# Altium project OpenPack_BATMOD_V1p0.PrjPcb
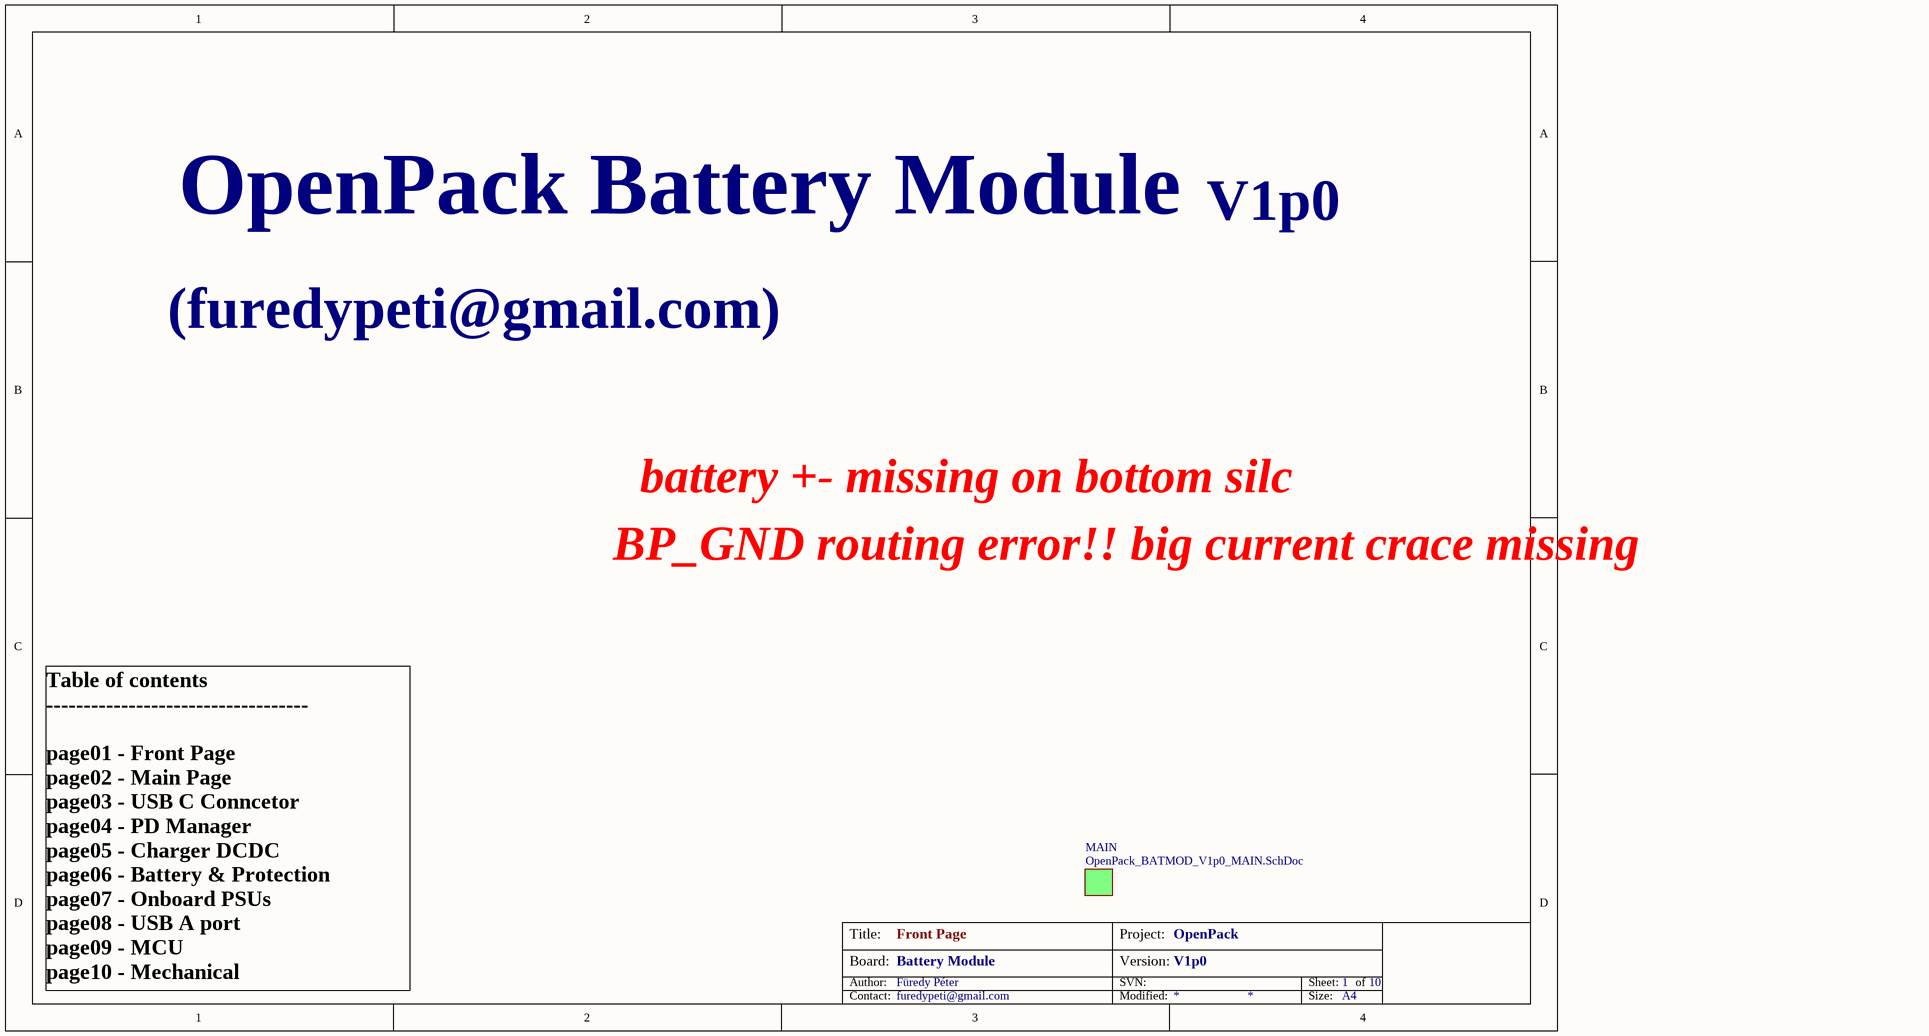
[diagram p0: OpenPack_BATMOD_V1p0_FRP.SchDoc]
GAuthor: Füredy Péter; GBoardName: Battery Module; GContact: furedypeti@gmail.com; GProjectName: OpenPack; GVersion: V1p0
10 sheets, 233 parts. Net scope: flat (ports and power ports of the same name join across sheets).
Board file: OpenPack_BATMOD_V1p0.PcbDoc
Sheets:
  OpenPack_BATMOD_V1p0_FRP.SchDoc
    MAIN = OpenPack_BATMOD_V1p0_MAIN.SchDoc
      MECH = OpenPack_BATMOD_V1p0_MECH.SchDoc
      CHRG = OpenPack_BATMOD_V1p0_CHRG.SchDoc
      PWR = OpenPack_BATMOD_V1p0_PWR.SchDoc
      MAN = OpenPack_BATMOD_V1p0_MAN.SchDoc
      USBC = OpenPack_BATMOD_V1p0_USBC.SchDoc
      USBA1 = OpenPack_BATMOD_V1p0_USBA.SchDoc
      USBA2 = OpenPack_BATMOD_V1p0_USBA.SchDoc
      BAT = OpenPack_BATMOD_V1p0_BAT.SchDoc
      MCU = OpenPack_BATMOD_V1p0_MCU.SchDoc

## Sheet OpenPack_BATMOD_V1p0_FRP.SchDoc
size A4; DocumentNumber: 1; SheetNumber: 1; SheetTotal: 10; Title_: Front Page

### Sub-sheets
MAIN = OpenPack_BATMOD_V1p0_MAIN.SchDoc: no entries

### Notes on the sheet
- (furedypeti@gmail.com)
- battery +- missing on bottom silc
- BP_GND routing error!! big current crace missing
- Table of contents
  -----------------------------------
  page01 - Front Page
  page02 - Main Page
  page03 - USB C Conncetor
  page04 - PD Manager
  page05 - Charger DCDC
  page06 - Battery & Protection
  page07 - Onboard PSUs
  page08 - USB A port
  page09 - MCU
  page10 - Mechanical
- Board:
- Author:
- Title:
- Project:
- SVN:
- Version:
- Sheet:
- of
- Contact:
- Modified:
- Size:
- A4

## Sheet OpenPack_BATMOD_V1p0_MAIN.SchDoc
size A4; SheetNumber: 2; SheetTotal: 10; Title_: Main Page
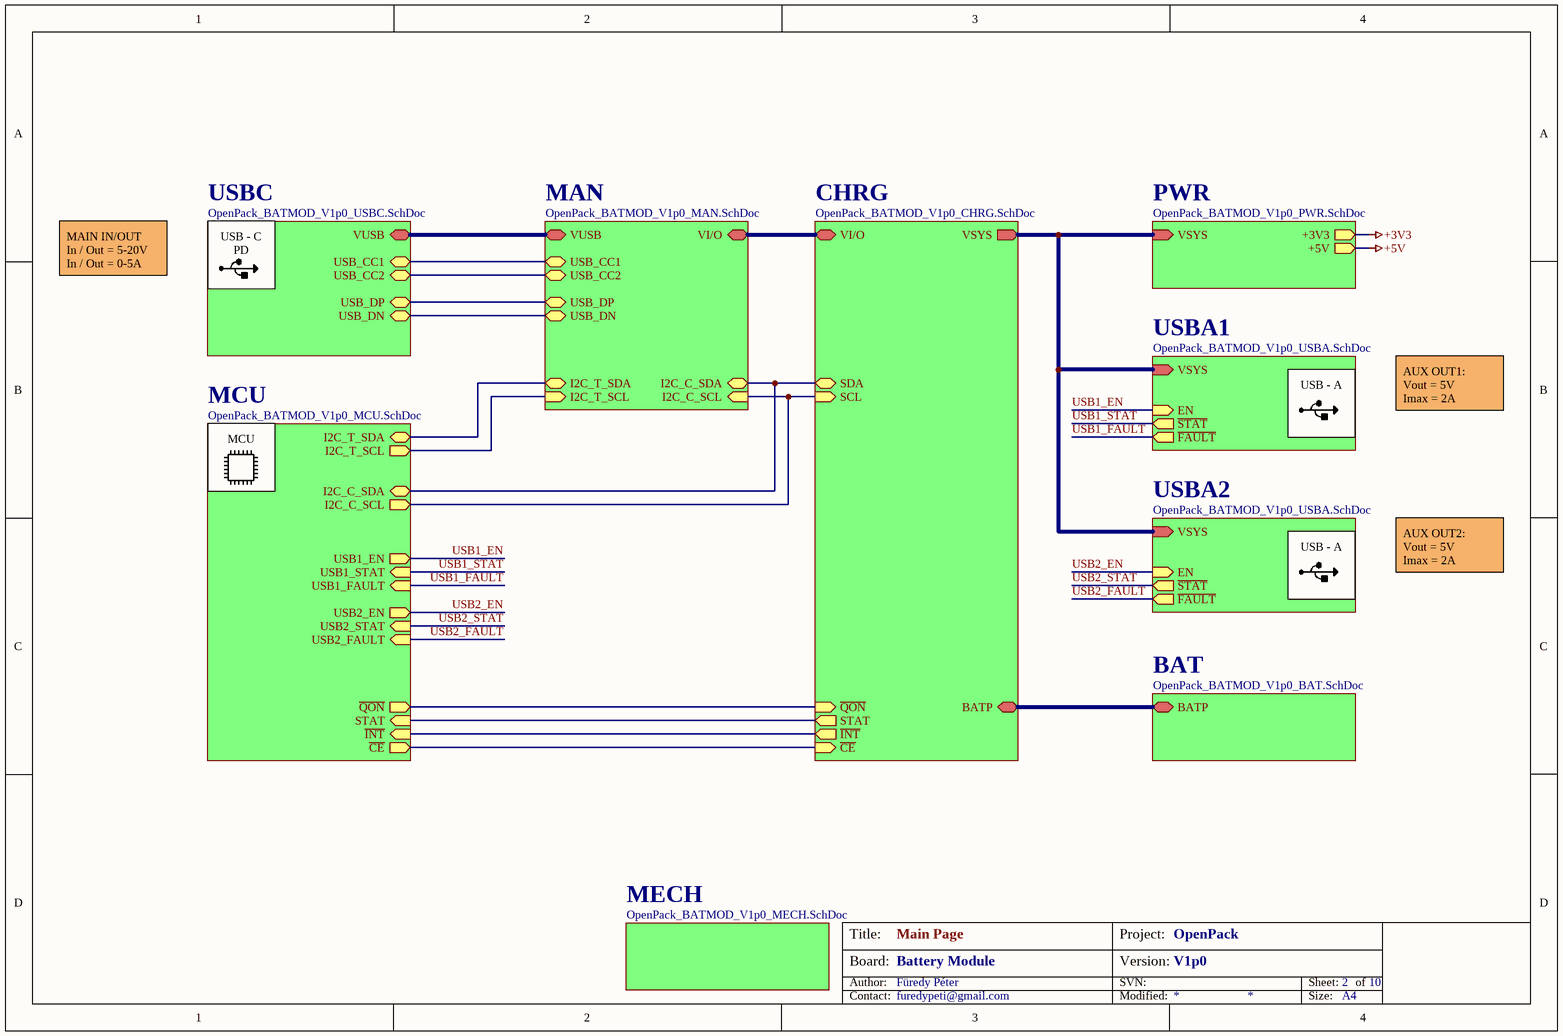
[diagram p1: OpenPack_BATMOD_V1p0_MAIN.SchDoc]

### Sub-sheets
BAT = OpenPack_BATMOD_V1p0_BAT.SchDoc: BATP (bidir)
CHRG = OpenPack_BATMOD_V1p0_CHRG.SchDoc: VI/O (bidir), VSYS (out), ~{CE} (in), ~{INT} (out), STAT (out), ~{QON} (in), SDA (bidir), SCL (in), BATP (bidir)
MAN = OpenPack_BATMOD_V1p0_MAN.SchDoc: VI/O (bidir), I2C_T_SDA (bidir), I2C_T_SCL (in), VUSB (bidir), USB_CC1 (bidir), USB_CC2 (bidir), USB_DP (bidir), USB_DN (bidir), I2C_C_SDA (bidir), I2C_C_SCL (in)
MCU = OpenPack_BATMOD_V1p0_MCU.SchDoc: ~{CE} (out), ~{QON} (out), STAT (in), ~{INT} (in), I2C_T_SDA (bidir), I2C_T_SCL (out), I2C_C_SDA (bidir), I2C_C_SCL (out), USB1_EN (out), USB1_STAT (in), USB1_FAULT (in), USB2_EN (out), USB2_STAT (in), USB2_FAULT (in)
MECH = OpenPack_BATMOD_V1p0_MECH.SchDoc: no entries
PWR = OpenPack_BATMOD_V1p0_PWR.SchDoc: VSYS (in), +3V3 (out), +5V (out)
USBA1 = OpenPack_BATMOD_V1p0_USBA.SchDoc: VSYS (in), EN (in), ~{STAT} (out), ~{FAULT} (out)
USBA2 = OpenPack_BATMOD_V1p0_USBA.SchDoc: VSYS (in), EN (in), ~{STAT} (out), ~{FAULT} (out)
USBC = OpenPack_BATMOD_V1p0_USBC.SchDoc: VUSB (bidir), USB_CC1 (bidir), USB_CC2 (bidir), USB_DP (bidir), USB_DN (bidir)

### Nets
USB1_EN: sheet USBA1/EN, sheet MCU/USB1_EN
USB1_FAULT: sheet USBA1/~{FAULT}, sheet MCU/USB1_FAULT
USB1_STAT: sheet USBA1/~{STAT}, sheet MCU/USB1_STAT
USB2_EN: sheet USBA2/EN, sheet MCU/USB2_EN
USB2_FAULT: sheet USBA2/~{FAULT}, sheet MCU/USB2_FAULT
USB2_STAT: sheet USBA2/~{STAT}, sheet MCU/USB2_STAT
(unnamed): sheet CHRG/VI/O, sheet MAN/VI/O
(unnamed): sheet CHRG/VSYS, sheet PWR/VSYS, sheet USBA1/VSYS, sheet USBA2/VSYS
(unnamed): sheet CHRG/~{CE}, sheet MCU/~{CE}
(unnamed): sheet CHRG/~{INT}, sheet MCU/~{INT}
(unnamed): sheet CHRG/STAT, sheet MCU/STAT
(unnamed): sheet CHRG/~{QON}, sheet MCU/~{QON}
(unnamed): sheet CHRG/SDA, sheet MAN/I2C_C_SDA, sheet MCU/I2C_C_SDA
(unnamed): sheet CHRG/SCL, sheet MAN/I2C_C_SCL, sheet MCU/I2C_C_SCL
(unnamed): sheet CHRG/BATP, sheet BAT/BATP
(unnamed): sheet MAN/I2C_T_SDA, sheet MCU/I2C_T_SDA
(unnamed): sheet MAN/I2C_T_SCL, sheet MCU/I2C_T_SCL
(unnamed): sheet MAN/VUSB, sheet USBC/VUSB
(unnamed): sheet MAN/USB_CC1, sheet USBC/USB_CC1
(unnamed): sheet MAN/USB_CC2, sheet USBC/USB_CC2
(unnamed): sheet MAN/USB_DP, sheet USBC/USB_DP
(unnamed): sheet MAN/USB_DN, sheet USBC/USB_DN

### Notes on the sheet
- USB - C
  PD
- MAIN IN/OUT
  In / Out = 5-20V
  In / Out = 0-5A
- USB - A
- AUX OUT1:
  Vout = 5V
  Imax = 2A
- MCU
- AUX OUT2:
  Vout = 5V
  Imax = 2A
- Board:
- Author:
- Title:
- Project:
- SVN:
- Version:
- Sheet:
- of
- Contact:
- Modified:
- Size:
- A4

## Sheet OpenPack_BATMOD_V1p0_MECH.SchDoc
size A4; SheetNumber: 10; SheetTotal: 10; Title_: Mechanical
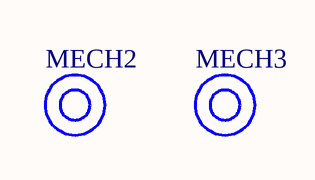
[diagram p2: OpenPack_BATMOD_V1p0_MECH.SchDoc]

### Parts
MECH2  Fiducial  [FIDU_1MM]  (value not drawn)  (no BOM)
MECH3  Fiducial  [FIDU_1MM]  (value not drawn)  (no BOM)

### Notes on the sheet
- Board:
- Author:
- Title:
- Project:
- SVN:
- Version:
- Sheet:
- of
- Contact:
- Modified:
- Size:
- A4

### Library data of the parts
MECH2 MECH3 = FIDU: Fiducatial, round, 1mm

## Sheet OpenPack_BATMOD_V1p0_CHRG.SchDoc
size A4; SheetNumber: 5; SheetTotal: 10; Title_: Battery Charger
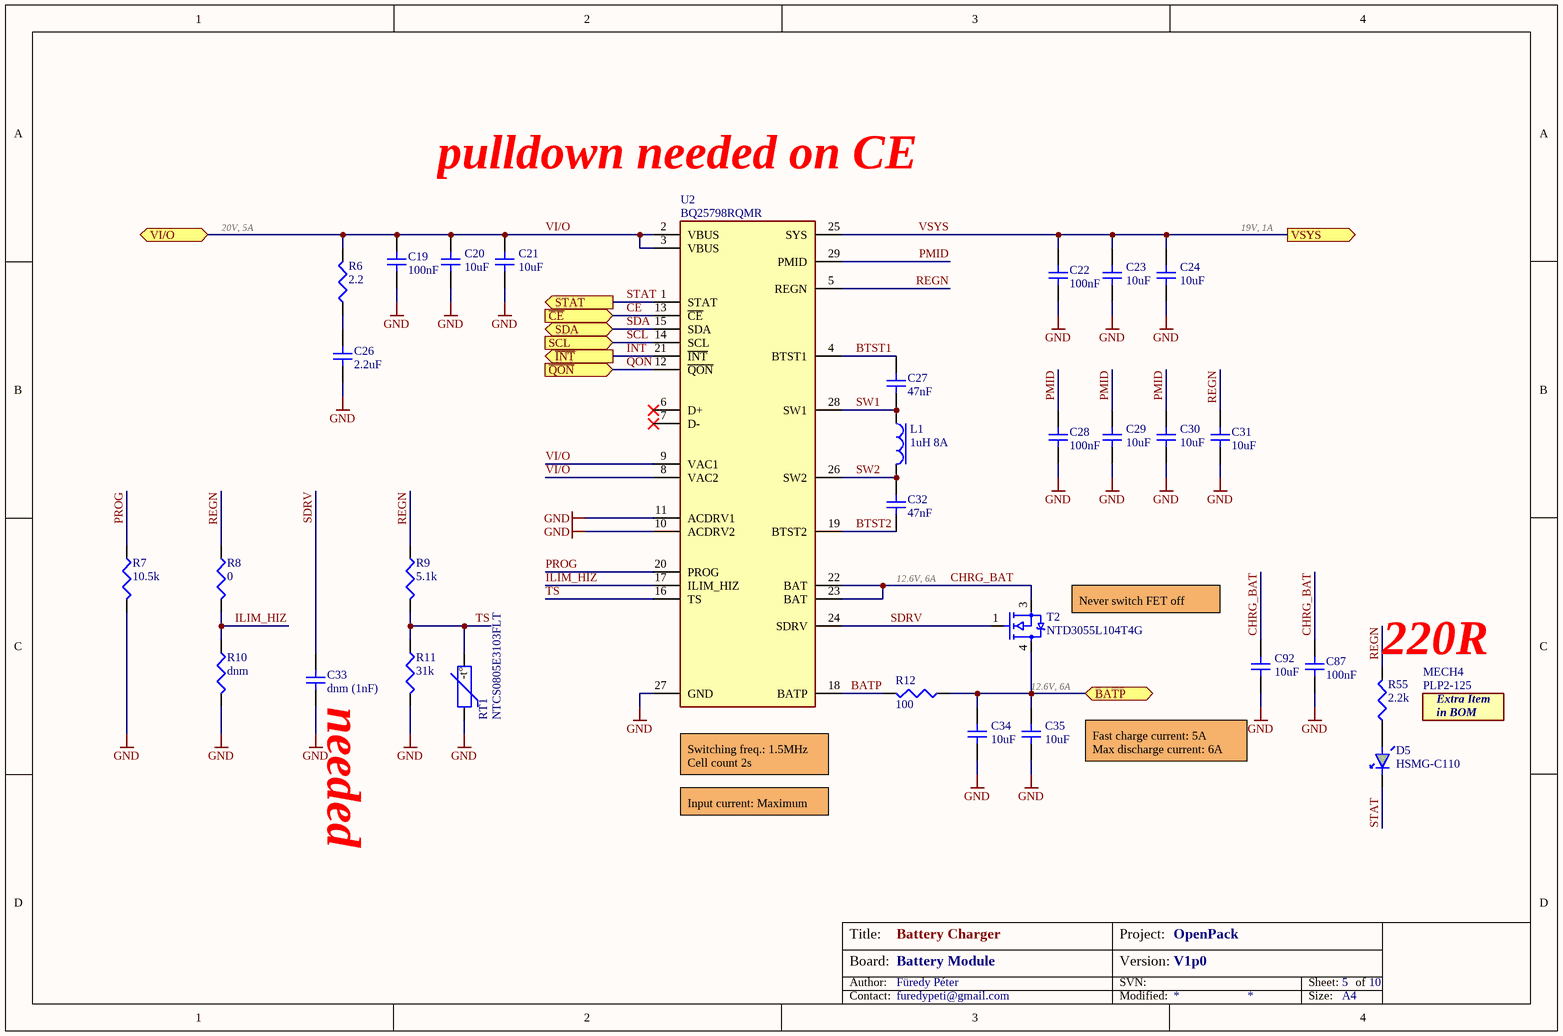
[diagram p3: OpenPack_BATMOD_V1p0_CHRG.SchDoc]

### Parts
C19  100nF  [CAP_0603]
C20  10uF  [CAP_1210]
C21  10uF  [CAP_1210]
C22  100nF  [CAP_0603]
C23  10uF  [CAP_1210]
C24  10uF  [CAP_1210]
C26  2.2uF  [CAP-0805]
C27  47nF  [CAP_0603]
C28  100nF  [CAP_0603]
C29  10uF  [CAP_1210]
C30  10uF  [CAP_1210]
C31  10uF  [CAP_0603]
C32  47nF  [CAP_0603]
C33  dnm (1nF)  [CAP_0603]
C34  10uF  [CAP_1210]
C35  10uF  [CAP_1210]
C87  100nF  [CAP_0603]
C92  10uF  [CAP_1210]
D5  HSMG-C110  [LED_SMD_90DEG_GRE]
L1  1uH 8A  [WE-LHMI_7030]
MECH4  PLP2-125  (mechanical)
R6  2.2  [RES-0805]
R7  10.5k  [RES-0603]
R8  0  [RES-0603]
R9  5.1k  [RES-0603]
R10  dnm  [RES-0603]
R11  31k  [RES-0603]
R12  100  [RES-0603]
R55  2.2k  [RES-0603]
RT1  NTCS0805E3103FLT  [RES-0805]
T2  NTD3055L104T4G  [DPAK]
U2  BQ25798RQMR  [QFN 29]

### Ports
BATP (bidir, see OpenPack_BATMOD_V1p0_MAIN, OpenPack_BATMOD_V1p0_BAT), SCL (in, see OpenPack_BATMOD_V1p0_MAIN), SDA (bidir, see OpenPack_BATMOD_V1p0_MAIN), STAT (out, see OpenPack_BATMOD_V1p0_MAIN, OpenPack_BATMOD_V1p0_MCU), VI/O (bidir, see OpenPack_BATMOD_V1p0_MAIN, OpenPack_BATMOD_V1p0_MAN), VSYS (out, see OpenPack_BATMOD_V1p0_MAIN, OpenPack_BATMOD_V1p0_PWR, OpenPack_BATMOD_V1p0_USBA), ~{CE} (in, see OpenPack_BATMOD_V1p0_MAIN, OpenPack_BATMOD_V1p0_MCU), ~{INT} (out, see OpenPack_BATMOD_V1p0_MAIN, OpenPack_BATMOD_V1p0_MCU), ~{QON} (in, see OpenPack_BATMOD_V1p0_MAIN, OpenPack_BATMOD_V1p0_MCU)

### Nets
GND: C19.1 C20.1 C21.1 C22.1 C23.1 C24.1 C26.1 C28.1 C29.1 C30.1 C31.1 C33.1 C34.1 C35.1 C87.1 C92.1 R7.2 R10.2 R11.2 RT1.1 U2.10(ACDRV2) U2.11(ACDRV1) U2.27(GND)
BATP: R12.2 U2.18(BATP)
BTST1: C27.2 U2.4(BTST1)
BTST2: C32.1 U2.19(BTST2)
~{CE}: U2.13(~{CE}) ; port ~{CE}
CHRG_BAT: C87.2 C92.2 T2.3(SOURCE) U2.22(BAT) U2.23(BAT)
~{INT}: U2.21(~{INT}) ; port ~{INT}
ILIM_HIZ: R8.2 R10.1 U2.17(ILIM_HIZ)
PMID: C28.2 C29.2 C30.2 U2.29(PMID)
PROG: R7.1 U2.20(PROG)
~{QON}: U2.12(~{QON}) ; port ~{QON}
REGN: C31.2 R8.1 R9.1 R55.1 U2.5(REGN)
SCL: U2.14(SCL) ; port SCL
SDA: U2.15(SDA) ; port SDA
SDRV: C33.2 T2.1 U2.24(SDRV)
STAT: D5.K U2.1(STAT) ; port STAT
SW1: C27.1 L1.1 U2.28(SW1)
SW2: C32.2 L1.2 U2.26(SW2)
TS: R9.2 R11.1 RT1.2 U2.16(TS)
VI/O: C19.2 C20.2 C21.2 R6.2 U2.2(VBUS) U2.3(VBUS) U2.8(VAC2) U2.9(VAC1) ; port VI/O
VSYS: C22.2 C23.2 C24.2 U2.25(SYS) ; port VSYS
NetBH1_2: C34.2 C35.2 R12.1 T2.4 ; port BATP
NetC26_2: C26.2 R6.1
NetD5_A: D5.A R55.2

Not connected (* = marked no-connect by the designer): U2 6(D+)* 7(D-)*

### Notes on the sheet
- pulldown needed on CE
- 20V, 5A
- 19V, 1A
- 12.6V, 6A
- Never switch FET off
- (near C33) needed
- (near R55) 220R
- (near U2) Switching freq.: 1.5MHz
  Cell count 2s
- Fast charge current: 5A
  Max discharge current: 6A
- Input current: Maximum
- Board:
- Author:
- Title:
- Project:
- SVN:
- Version:
- Sheet:
- of
- Contact:
- Modified:
- Size:
- A4
- (in symbol NTCS0805E3103FLT) -t°
- (in symbol PLP2-125) Extra Item; in BOM

### Library data of the parts
C19 C22 C26-C28 C31-C33 C87 = NP-CAPACITOR: MLCC capacitor; Type: CAP
C20 C21 C23 C24 C29 C30 C34 C35 C92 = NP-CAPACITOR: UMK325BJ106KM-P; Part number: 810-CGA6P1X7R1N106K2; Type: CAP; Supplier: Mouser
D5 = HSMG-C110: Green LED, 90deg; Part number: 630-HSMG-C110; Type: Diode; ComponentLink1Description: Datasheet; ComponentLink1URL: AV02_0551EN_DS_HSMx_Cxxx.pdf; Supplier: Mouser; ComponentLink2Description: Order; ComponentLink2URL: https://hu.mouser.com/ProductDetail/Broadcom-Avago/HSMG-C110?qs=YDL0qNrpDT4yGVa8S%252B44dw%3D%3D
L1 = Inductance - 1uH: Ferrit core coil, 1uH 8A, 10mR; Part number: 710-74437346010; Type: IND; Supplier: Mouser; ComponentLink1Description: Datasheet; ComponentLink2Description: Order; ComponentLink2URL: https://hu.mouser.com/en/ProductDetail/Wurth-Elektronik/74437346010?qs=cFlH0mFHHFoJDXer0S4nbw%3D%3D
MECH4 = PLP2-125: LED Light Pipe, 3mm round lense; Part number: 749-PLP2-125; Type: MECH; Supplier: Mouser; ComponentLink1Description: Datasheet; ComponentLink1URL: PLP2_XXX-3001748.pdf; ComponentLink2Description: Order; ComponentLink2URL: https://hu.mouser.com/ProductDetail/Bivar/PLP2-125?qs=6qR8IwHvvodoR2yuSMLqUA%3D%3D
R6-R12 R55 = RESISTOR: Metal Film Resistor; Type: RES
RT1 = NTCS0805E3103FLT: NTC (Negative Temperature Coefficient) Thermistors 10Kohms 1%; Part number: 594-NTCS0805E3103FLT; Supplier: Mouser; Type: RES; ComponentLink1Description: Datasheet; ComponentLink2Description: Order; ComponentLink2URL: https://hu.mouser.com/en/ProductDetail/Vishay-BC-Components/NTCS0805E3103FLT?qs=%2FWiulJ9oly4Pd4lidS66Yw%3D%3D
T2 = NTD3055L104T4G: Power NMOSFET; Part number: 863-NTD3055L104T4G; Type: FET; ComponentLink1Description: Datasheet; Supplier: Mouser; ComponentLink2Description: Order; ComponentLink2URL: https://hu.mouser.com/en/ProductDetail/onsemi/NTD3055L104T4G?qs=ZXBb0xZ9WeBCRGuurIKQ8A%3D%3D
U2 = BQ25798RQMR: Battery Management I C controlled 1-4- cell 5-A buck-boost; Part number: 595-BQ25798RQMR; ComponentLink1Description: Datasheet; Supplier: Mouser; ComponentLink2Description: Order; ComponentLink2URL: https://hu.mouser.com/en/ProductDetail/Texas-Instruments/BQ25798RQMR?qs=ljCeji4nMDmr66dwAbNsCg%3D%3D; Type: IC

## Sheet OpenPack_BATMOD_V1p0_PWR.SchDoc
size A4; SheetNumber: 7; SheetTotal: 10; Title_: Local PSU
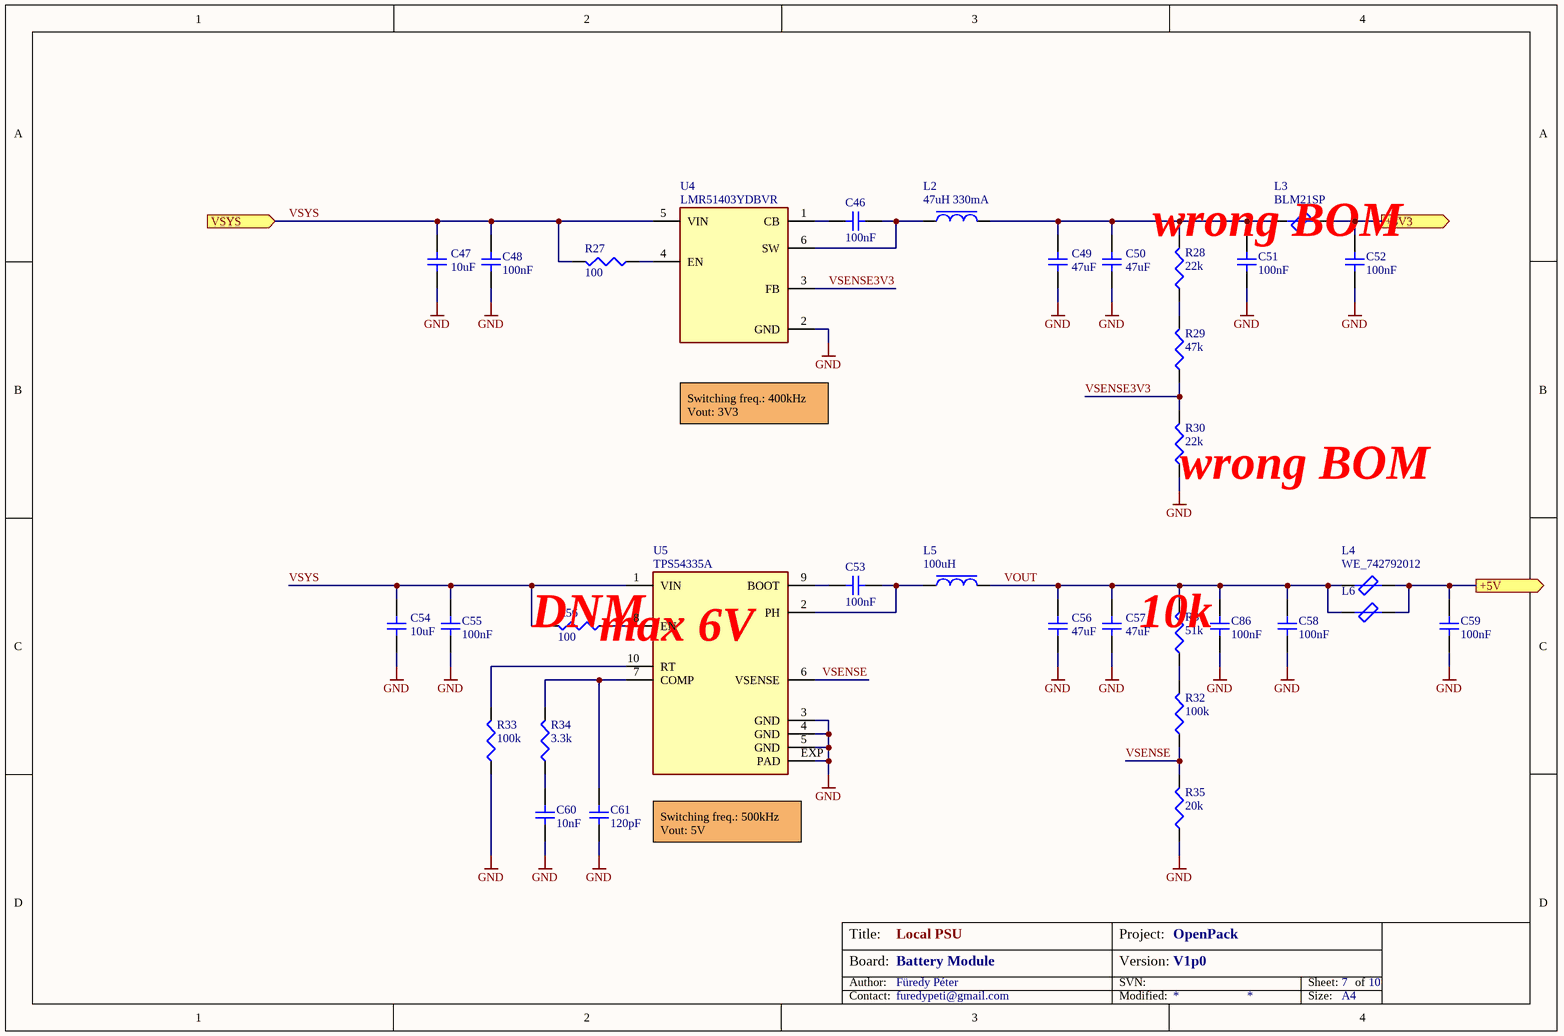
[diagram p4: OpenPack_BATMOD_V1p0_PWR.SchDoc]

### Parts
C46  100nF  [CAP_0603]
C47  10uF  [CAP_1210]
C48  100nF  [CAP_0603]
C49  47uF  [CAP_1210]
C50  47uF  [CAP_1210]
C51  100nF  [CAP_0603]
C52  100nF  [CAP_0603]
C53  100nF  [CAP_0603]
C54  10uF  [CAP_1210]
C55  100nF  [CAP_0603]
C56  47uF  [CAP_1210]
C57  47uF  [CAP_1210]
C58  100nF  [CAP_0603]
C59  100nF  [CAP_0603]
C60  10nF  [CAP_0603]
C61  120pF  [CAP_0603]
C86  100nF  [CAP_0603]
L2  47uH 330mA  [IND_1210]
L3  BLM21SP  [IND-0805]
L4  WE_742792012  [IND-0805]
L5  100uH  [IND_2]
L6  WE_742792012  [IND-0805]  (value not drawn)
R27  100  [RES-0603]
R28  22k  [RES-0603]
R29  47k  [RES-0603]
R30  22k  [RES-0603]
R31  51k  [RES-0603]
R32  100k  [RES-0603]
R33  100k  [RES-0603]
R34  3.3k  [RES-0603]
R35  20k  [RES-0603]
R56  100  [RES-0603]
U4  LMR51403YDBVR  [SOT-23-6]
U5  TPS54335A  [VSON-10]

### Ports
+3V3 (out, see OpenPack_BATMOD_V1p0_MAIN), +5V (out, see OpenPack_BATMOD_V1p0_MAIN), VSYS (in, see OpenPack_BATMOD_V1p0_MAIN, OpenPack_BATMOD_V1p0_CHRG, OpenPack_BATMOD_V1p0_USBA)

### Nets
GND: C47.1 C48.2 C49.1 C50.1 C51.2 C52.2 C54.1 C55.2 C56.1 C57.1 C58.2 C59.2 C60.2 C61.2 C86.2 R30.1 R33.1 R35.1 U4.2(GND) U5.3(GND) U5.4(GND) U5.5(GND) U5.EXP(PAD)
VOUT: C56.2 C57.2 C58.1 C86.1 L4.1 L5.2 L6.1 R31.2
VSENSE: R32.1 R35.2 U5.6(VSENSE)
VSENSE3V3: R29.1 R30.2 U4.3(FB)
VSYS: C47.2 C48.1 C54.2 C55.1 R27.2 R56.2 U4.5(VIN) U5.1(VIN) ; port VSYS
NetC46_1: C46.1 L2.1 U4.6(SW)
NetC46_2: C46.2 U4.1(CB)
NetC49_2: C49.2 C50.2 C51.1 L2.2 L3.1 R28.2
NetC52_1: C52.1 L3.2 ; port +3V3
NetC53_1: C53.1 L5.1 U5.2(PH)
NetC53_2: C53.2 U5.9(BOOT)
NetC59_1: C59.1 L4.2 L6.2 ; port +5V
NetC60_1: C60.1 R34.1
NetC61_1: C61.1 R34.2 U5.7(COMP)
NetR27_1: R27.1 U4.4(EN)
NetR28_1: R28.1 R29.2
NetR31_1: R31.1 R32.2
NetR33_2: R33.2 U5.10(RT)
NetR56_1: R56.1 U5.8(EN)

### Notes on the sheet
- wrong BOM
- Switching freq.: 400kHz
  Vout: 3V3
- (near R30) wrong BOM
- (near R56) DNM
- max 6V
- (near R31) 10k
- Switching freq.: 500kHz
  Vout: 5V
- Board:
- Author:
- Title:
- Project:
- SVN:
- Version:
- Sheet:
- of
- Contact:
- Modified:
- Size:
- A4

### Library data of the parts
C46 C48 C51-C53 C55 C58-C61 C86 = NP-CAPACITOR: MLCC capacitor; Type: CAP
C47 C54 = NP-CAPACITOR: as C20 on sheet OpenPack_BATMOD_V1p0_CHRG; Supplier: Mouser
C49 C50 C56 C57 = NP-CAPACITOR: Np-Cap; Part number: 80-C1210C476M4P; Type: CAP; Supplier: Mouser
L2 = Inductance - 47uH: Power inductor; Part number: 81-LQH32PN470MN0L; Type: IND; Supplier: Mouser; ComponentLink1Description: Datasheet; ComponentLink2Description: Order; ComponentLink2URL: https://hu.mouser.com/en/ProductDetail/Murata-Electronics/LQH32PN470MN0L?qs=18WYLvqSxErKIEyluVLVKQ%3D%3D
L3 = BLM21SP102SN1D: Chip Ferrite Bead, 1000R @100MHz, 1.6A; Part number: 81-BLM21SP102SN1D; Type: IND; Supplier: Mouser; ComponentLink1Description: Datasheet; ComponentLink1URL: ENFA0005-1915781.pdf; ComponentLink2Description: Order; ComponentLink2URL: https://hu.mouser.com/ProductDetail/Murata-Electronics/BLM21SP102SN1D?qs=17u8i%2FzlE88oj6hmj%252BXptA%3D%3D
L4 L6 = WE_742792012: Chip Ferrite Bead, 33R @100MHz, 4A; Part number: 710-742792012; Type: IND; Supplier: Mouser; ComponentLink1Description: Datasheet; ComponentLink2Description: Order; ComponentLink2URL: https://hu.mouser.com/en/ProductDetail/Wurth-Elektronik/742792012?qs=J4sk5G6CMwb1B4GP%2Fe%2FxmA%3D%3D
L5 = Inductance - 22uH: Ferrit core coil, 22uH 2.85A, 75mR; Part number: 994-MSS1038T-223MLC; Type: IND; Supplier: Mouser; ComponentLink1Description: Datasheet; ComponentLink2Description: Order; ComponentLink2URL: https://hu.mouser.com/en/ProductDetail/Coilcraft/MSS1038T-223MLC?qs=zCSbvcPd3pYngswiQ3YHhA%3D%3D
R27-R35 R56 = RESISTOR: Metal Film Resistor; Type: RES
U4 = LMR51403YDBVR: Switching Voltage Regulators 4.5V-to-42V 0.3A syn chronous buck conve; Part number: 595-LMR51403YDBVR; Supplier: Mouser; ComponentLink1Description: Datasheet; ComponentLink2Description: Order; ComponentLink2URL: https://hu.mouser.com/en/ProductDetail/Texas-Instruments/LMR51403YDBVR?qs=a2MtRaTmNOSR%252BGtnOaFIVg%3D%3D; Type: PWR-REG
U5 = TPS54335A: Switching Voltage Regulators 4.5Vto28VInp 3A Sync Step-Down Converter A 595-TPS54335ADRCT; Part number: 595-TPS54335ADRCR; Supplier: Mouser; ComponentLink1Description: Datasheet; ComponentLink2Description: Order; ComponentLink2URL: https://hu.mouser.com/en/ProductDetail/Texas-Instruments/TPS54335ADRCR?qs=ADSrZYdIRCdK%252Bcxbafh6hw%3D%3D; Type: PWR-REG

## Sheet OpenPack_BATMOD_V1p0_MAN.SchDoc
size A4; SheetNumber: 4; SheetTotal: 10; Title_: USB C Manager
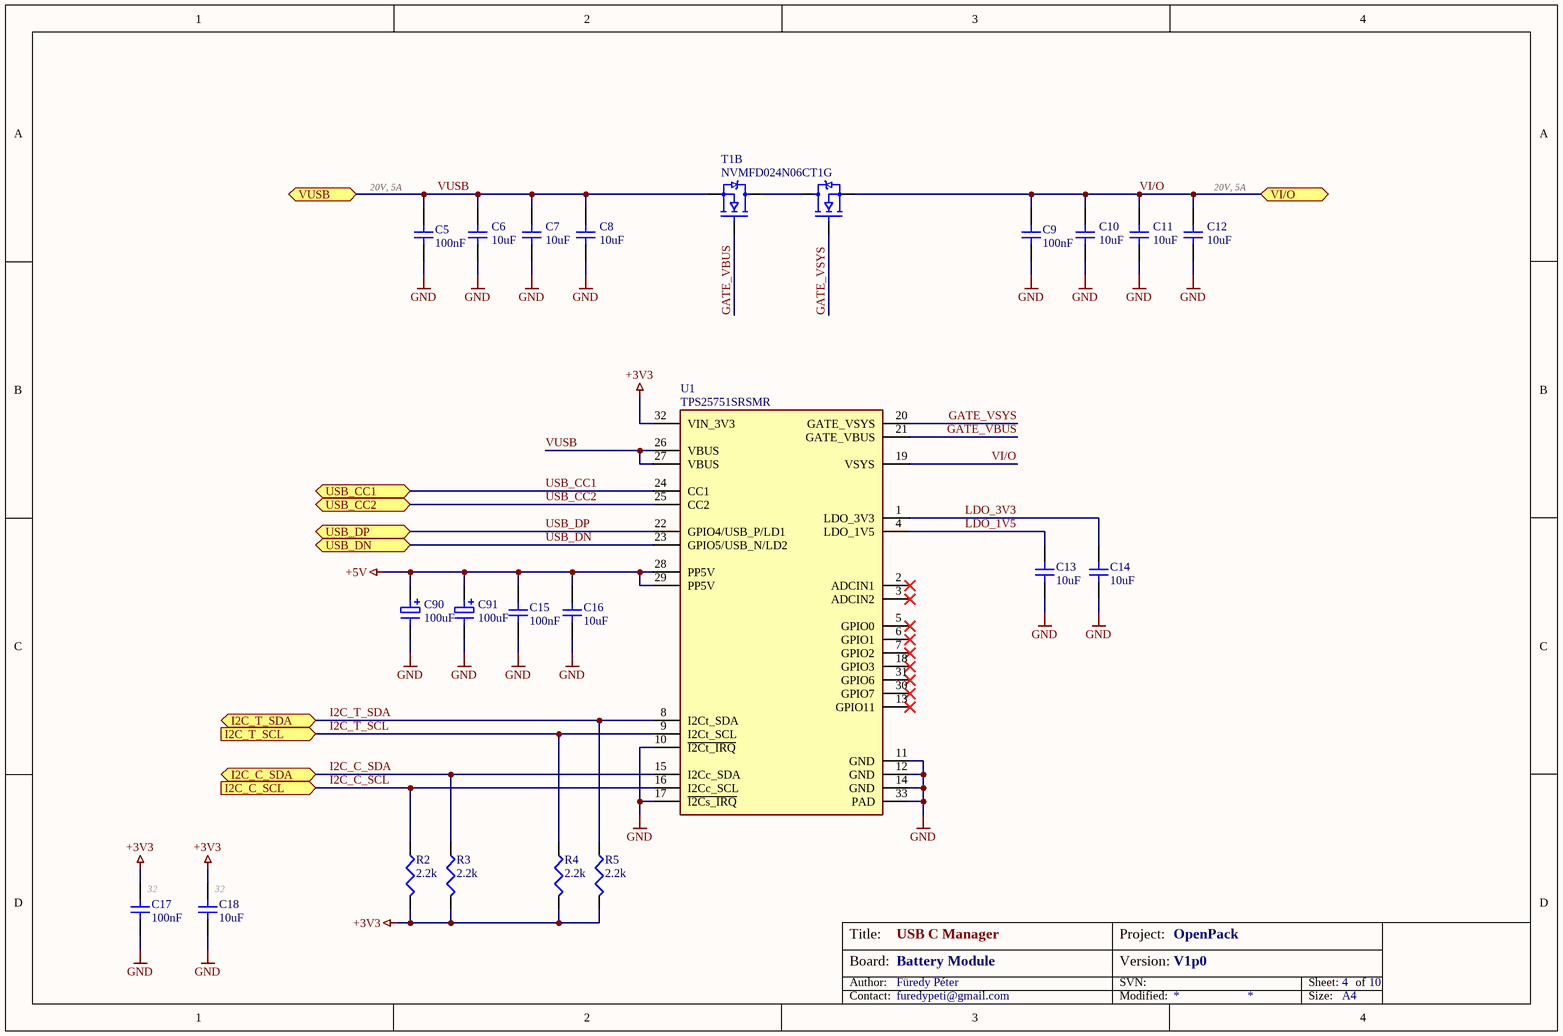
[diagram p5: OpenPack_BATMOD_V1p0_MAN.SchDoc]

### Parts
C5  100nF  [CAP_0603]
C6  10uF  [CAP_1210]
C7  10uF  [CAP_1210]
C8  10uF  [CAP_1210]
C9  100nF  [CAP_0603]
C10  10uF  [CAP_1210]
C11  10uF  [CAP_1210]
C12  10uF  [CAP_1210]
C13  10uF  [CAP_0603]
C14  10uF  [CAP_0603]
C15  100nF  [CAP_0603]
C16  10uF  [CAP_0603]
C17  100nF  [CAP_0603]
C18  10uF  [CAP_0603]
C90  100uF  [CAP-SMD-6.3X7.7]
C91  100uF  [CAP-SMD-6.3X7.7]
R2  2.2k  [RES-0603]
R3  2.2k  [RES-0603]
R4  2.2k  [RES-0603]
R5  2.2k  [RES-0603]
T1  NVMFD024N06CT1G  [SO-8FL (DFN8)]  (value not drawn)  (parts A,B of 2)
U1  TPS25751SRSMR  [QFN32 - 0.4mm]

### Ports
I2C_C_SCL (in, see OpenPack_BATMOD_V1p0_MAIN, OpenPack_BATMOD_V1p0_MCU), I2C_C_SDA (bidir, see OpenPack_BATMOD_V1p0_MAIN, OpenPack_BATMOD_V1p0_MCU), I2C_T_SCL (in, see OpenPack_BATMOD_V1p0_MAIN, OpenPack_BATMOD_V1p0_MCU), I2C_T_SDA (bidir, see OpenPack_BATMOD_V1p0_MAIN, OpenPack_BATMOD_V1p0_MCU), USB_CC1 (bidir, see OpenPack_BATMOD_V1p0_MAIN, OpenPack_BATMOD_V1p0_USBC), USB_CC2 (bidir, see OpenPack_BATMOD_V1p0_MAIN, OpenPack_BATMOD_V1p0_USBC), USB_DN (bidir, see OpenPack_BATMOD_V1p0_MAIN, OpenPack_BATMOD_V1p0_USBC), USB_DP (bidir, see OpenPack_BATMOD_V1p0_MAIN, OpenPack_BATMOD_V1p0_USBC), VI/O (bidir, see OpenPack_BATMOD_V1p0_MAIN, OpenPack_BATMOD_V1p0_CHRG), VUSB (bidir, see OpenPack_BATMOD_V1p0_MAIN, OpenPack_BATMOD_V1p0_USBC)

### Nets
+3V3: C17.2 C18.2 R2.2 R3.2 R4.2 R5.2 U1.32(VIN_3V3)
+5V: C15.2 C16.2 C90.1 C91.1 U1.28(PP5V) U1.29(PP5V)
GND: C5.1 C6.1 C7.1 C8.1 C9.1 C10.1 C11.1 C12.1 C13.1 C14.1 C15.1 C16.1 C17.1 C18.1 C90.2 C91.2 U1.10(~{I2Ct_IRQ}) U1.11(GND) U1.12(GND) U1.14(GND) U1.17(~{I2Cs_IRQ}) U1.33(PAD)
GATE_VBUS: T1.4 U1.21(GATE_VBUS)
GATE_VSYS: T1.2 U1.20(GATE_VSYS)
I2C_C_SCL: R2.1 U1.16(I2Cc_SCL) ; port I2C_C_SCL
I2C_C_SDA: R3.1 U1.15(I2Cc_SDA) ; port I2C_C_SDA
I2C_T_SCL: R4.1 U1.9(I2Ct_SCL) ; port I2C_T_SCL
I2C_T_SDA: R5.1 U1.8(I2Ct_SDA) ; port I2C_T_SDA
LDO_1V5: C13.2 U1.4(LDO_1V5)
LDO_3V3: C14.2 U1.1(LDO_3V3)
USB_CC1: U1.24(CC1) ; port USB_CC1
USB_CC2: U1.25(CC2) ; port USB_CC2
USB_DN: U1.23(GPIO5/USB_N/LD2) ; port USB_DN
USB_DP: U1.22(GPIO4/USB_P/LD1) ; port USB_DP
VI/O: C9.2 C10.2 C11.2 C12.2 T1.1 U1.19(VSYS) ; port VI/O
VUSB: C5.2 C6.2 C7.2 C8.2 T1.3 U1.26(VBUS) U1.27(VBUS) ; port VUSB
NetT1_9: T1.9 T1.10

Not connected (* = marked no-connect by the designer): U1 2(ADCIN1)* 3(ADCIN2)* 5(GPIO0)* 6(GPIO1)* 7(GPIO2)* 13(GPIO11)* 18(GPIO3)* 30(GPIO7)* 31(GPIO6)*

### Notes on the sheet
- (near C5) 20V, 5A
- (near C12) 20V, 5A
- (near C17) 32
- (near C18) 32
- Board:
- Author:
- Title:
- Project:
- SVN:
- Version:
- Sheet:
- of
- Contact:
- Modified:
- Size:
- A4

### Library data of the parts
C5 C9 C13-C18 = NP-CAPACITOR: MLCC capacitor; Type: CAP
C6-C8 C10-C12 = NP-CAPACITOR: as C20 on sheet OpenPack_BATMOD_V1p0_CHRG; Supplier: Mouser
C90 C91 = P-CAPACITOR: ELCO capacitor; Type: CAP
R2-R5 = RESISTOR: Metal Film Resistor; Type: RES
T1 = NVMFD024N06CT1G: Power NMOSFET Dual, 60V, 24A, 22mΩ; Part number: 863-NVMFD024N06CT1G; Type: FET; ComponentLink1Description: Datasheet; Supplier: Mouser; ComponentLink2Description: Order; ComponentLink2URL: https://hu.mouser.com/en/ProductDetail/onsemi/NVMFD024N06CT1G?qs=GedFDFLaBXEbovCJp2BRhQ%3D%3D
U1 = TPS25751SRSMR: USB Interface IC USB Type-C and USB P ower Delivery (PD); Part number: 595-TPS25751SRSMR; ComponentLink1Description: Datasheet; Supplier: Mouser; ComponentLink2Description: Order; ComponentLink2URL: https://hu.mouser.com/en/ProductDetail/Texas-Instruments/TPS25751SRSMR?qs=2wMNvWM5ZX4s3a9I%252B6VO9w%3D%3D; Type: IC

## Sheet OpenPack_BATMOD_V1p0_USBC.SchDoc
size A4; SheetNumber: 3; SheetTotal: 10; Title_: USB C Connector
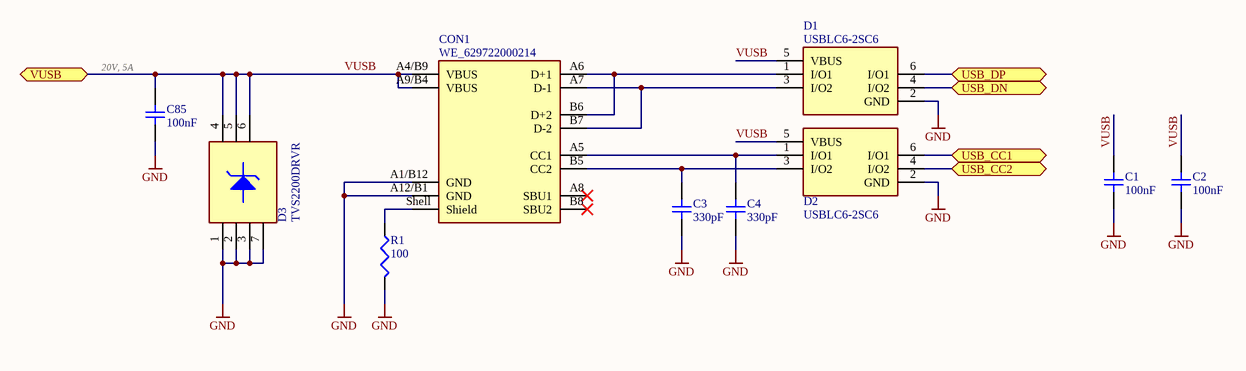
[diagram p6: OpenPack_BATMOD_V1p0_USBC.SchDoc]

### Parts
C1  100nF  [CAP_0603]
C2  100nF  [CAP_0603]
C3  330pF  [CAP_0603]
C4  330pF  [CAP_0603]
C85  100nF  [CAP_0603]
CON1  WE_629722000214  [WE_629722000214]
D1  USBLC6-2SC6  [SOT-23-6]
D2  USBLC6-2SC6  [SOT-23-6]
D3  TVS2200DRVR  [WSON-6]
R1  100  [RES-0603]

### Ports
USB_CC1 (bidir, see OpenPack_BATMOD_V1p0_MAIN, OpenPack_BATMOD_V1p0_MAN), USB_CC2 (bidir, see OpenPack_BATMOD_V1p0_MAIN, OpenPack_BATMOD_V1p0_MAN), USB_DN (bidir, see OpenPack_BATMOD_V1p0_MAIN, OpenPack_BATMOD_V1p0_MAN), USB_DP (bidir, see OpenPack_BATMOD_V1p0_MAIN, OpenPack_BATMOD_V1p0_MAN), VUSB (bidir, see OpenPack_BATMOD_V1p0_MAIN, OpenPack_BATMOD_V1p0_MAN)

### Nets
GND: C1.1 C2.1 C3.1 C4.1 C85.1 CON1.A1/B12(GND) CON1.A12/B1(GND) D1.2(GND) D2.2(GND) D3.1(GND) D3.2(GND) D3.3(GND) D3.7(GND) R1.2
USB_CC1: D2.6(I/O1) ; port USB_CC1
USB_CC2: D2.4(I/O2) ; port USB_CC2
USB_DN: D1.4(I/O2) ; port USB_DN
USB_DP: D1.6(I/O1) ; port USB_DP
VUSB: C1.2 C2.2 C85.2 CON1.A4/B9(VBUS) CON1.A9/B4(VBUS) D1.5(VBUS) D2.5(VBUS) D3.4(IN) D3.5(IN) D3.6(IN) ; port VUSB
NetC3_2: C3.2 CON1.B5(CC2) D2.3(I/O2)
NetC4_2: C4.2 CON1.A5(CC1) D2.1(I/O1)
NetCON1_A6: CON1.A6(D+1) CON1.B6(D+2) D1.1(I/O1)
NetCON1_A7: CON1.A7(D-1) CON1.B7(D-2) D1.3(I/O2)
NetCON1_Shell: CON1.Shell(Shield) R1.1

Not connected (* = marked no-connect by the designer): CON1 A8(SBU1)* B8(SBU2)*

### Notes on the sheet
- (near C85) 20V, 5A
- Board:
- Author:
- Title:
- Project:
- SVN:
- Version:
- Sheet:
- of
- Contact:
- Modified:
- Size:
- A4

### Library data of the parts
C1-C4 C85 = NP-CAPACITOR: MLCC capacitor; Type: CAP
CON1 = WE_629722000214: USB Connectors WR-COM Receptacle USB 2.0 Type C Horizontal SMT 16 pins- PCB Thickness 0.8mm; Part number: 710-629722000214; ComponentLink1Description: Datasheet; Supplier: Mouser; ComponentLink2Description: Order; ComponentLink2URL: https://hu.mouser.com/en/ProductDetail/Wurth-Elektronik/629722000214?qs=1Kr7Jg1SGW93XYhc8K3hvA%3D%3D; Type: CON?
D1 D2 = USBLC6-2SC6: ESD Protection Diodes / TVS Diodes ESD Protection Low Cap; Part number: 511-USBLC6-2SC6; Type: Diode; Supplier: Mouser; ComponentLink1Description: Datasheet; ComponentLink2Description: Order; ComponentLink2URL: https://hu.mouser.com/en/ProductDetail/STMicroelectronics/USBLC6-2SC6?qs=po45yt2pPpu%2FhNIlwQdTlg%3D%3D
D3 = TVS2200DRVR: ESD Protection Diodes / TVS Diodes 22V flat-clamp surge protection device 6; Part number: 595-TVS2200DRVR; Type: Diode; Supplier: Mouser; ComponentLink1Description: Datasheet; ComponentLink2Description: Order; ComponentLink2URL: https://hu.mouser.com/en/ProductDetail/Texas-Instruments/TVS2200DRVR?qs=W0yvOO0ixfHPbvei2cYdIw%3D%3D
R1 = RESISTOR: Metal Film Resistor; Type: RES

## Sheet OpenPack_BATMOD_V1p0_USBA.SchDoc
size A4; SheetNumber: 8; SheetTotal: 10; Title_: USB A Port
Used 2 times, as channels MAIN/USBA1, MAIN/USBA2. Parts and nets are listed once, with the designators drawn on the sheet.
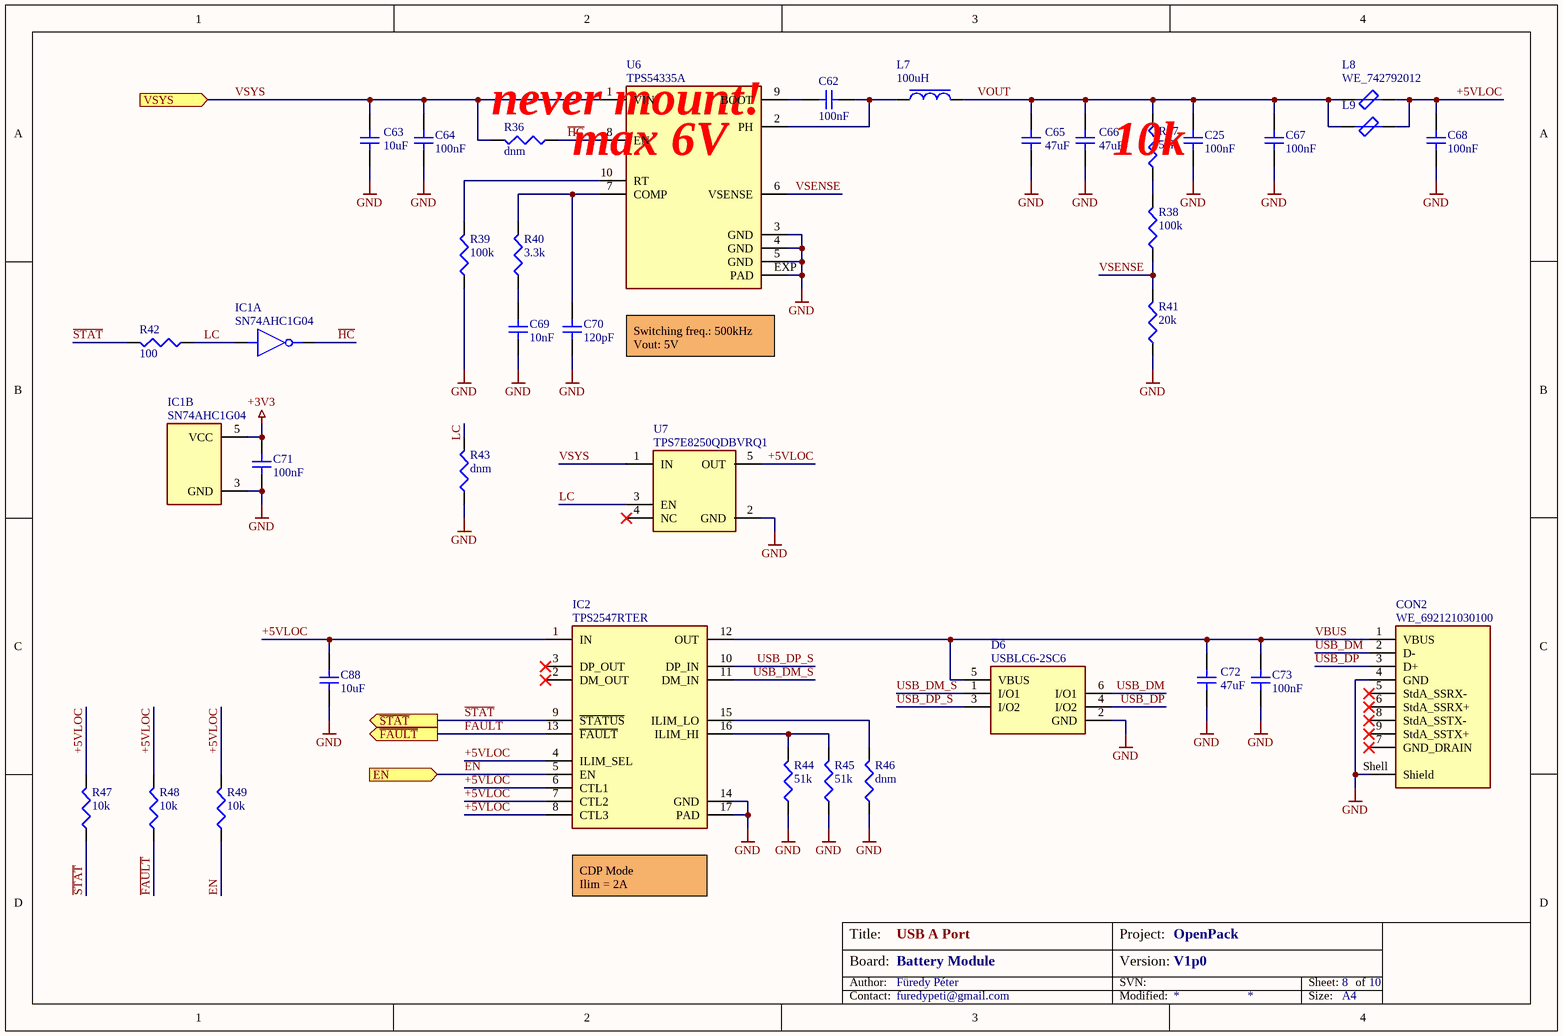
[diagram p7: OpenPack_BATMOD_V1p0_USBA.SchDoc]

### Parts
C25  100nF  [CAP_0603]
C62  100nF  [CAP_0603]
C63  10uF  [CAP_1210]
C64  100nF  [CAP_0603]
C65  47uF  [CAP_1210]
C66  47uF  [CAP_1210]
C67  100nF  [CAP_0603]
C68  100nF  [CAP_0603]
C69  10nF  [CAP_0603]
C70  120pF  [CAP_0603]
C71  100nF  [CAP_0603]
C72  47uF  [CAP_1210]
C73  100nF  [CAP_0603]
C88  10uF  [CAP_0603]
CON2  WE_692121030100  [WE_692121030100]
D6  USBLC6-2SC6  [SOT-23-6]
IC1  SN74AHC1G04  [SC-70-5]  (parts A,B of 2)
IC2  TPS2547RTER  [QFN-16]
L7  100uH  [IND_2]
L8  WE_742792012  [IND-0805]
L9  WE_742792012  [IND-0805]  (value not drawn)
R36  dnm  [RES-0603]
R37  51k  [RES-0603]
R38  100k  [RES-0603]
R39  100k  [RES-0603]
R40  3.3k  [RES-0603]
R41  20k  [RES-0603]
R42  100  [RES-0603]
R43  dnm  [RES-0603]
R44  51k  [RES-0603]
R45  51k  [RES-0603]
R46  dnm  [RES-0603]
R47  10k  [RES-0603]
R48  10k  [RES-0603]
R49  10k  [RES-0603]
U6  TPS54335A  [VSON-10]
U7  TPS7E8250QDBVRQ1  [SOT-23-5]

### Ports
EN (in, see OpenPack_BATMOD_V1p0_MAIN), VSYS (in, see OpenPack_BATMOD_V1p0_MAIN, OpenPack_BATMOD_V1p0_CHRG, OpenPack_BATMOD_V1p0_PWR), ~{FAULT} (out, see OpenPack_BATMOD_V1p0_MAIN), ~{STAT} (out, see OpenPack_BATMOD_V1p0_MAIN)

### Nets
+3V3: C71.1 IC1.5(VCC)
GND: C25.2 C63.1 C64.2 C65.1 C66.1 C67.2 C68.2 C69.2 C70.2 C71.2 C72.1 C73.2 C88.1 CON2.4(GND) CON2.Shell(Shield) D6.2(GND) IC1.3(GND) IC2.14(GND) IC2.17(PAD) R39.1 R41.1 R43.1 R44.1 R45.1 R46.1 U6.3(GND) U6.4(GND) U6.5(GND) U6.EXP(PAD) U7.2(GND)
+5VLOC: C68.1 C88.2 IC2.1(IN) IC2.4(ILIM_SEL) IC2.6(CTL1) IC2.7(CTL2) IC2.8(CTL3) L8.2 L9.2 R47.2 R48.2 R49.2 U7.5(OUT)
EN: IC2.5(EN) R49.1 ; port EN
~{FAULT}: IC2.13(~{FAULT}) R48.1 ; port ~{FAULT}
~{HC}: IC1.4(Y) R36.1 U6.8(EN)
LC: IC1.2(A) R42.1 R43.2 U7.3(EN)
~{STAT}: IC2.9(~{STATUS}) R42.2 R47.1 ; port ~{STAT}
USB_DM: CON2.2(D-) D6.6(I/O1)
USB_DM_S: D6.1(I/O1) IC2.11(DM_IN)
USB_DP: CON2.3(D+) D6.4(I/O2)
USB_DP_S: D6.3(I/O2) IC2.10(DP_IN)
VBUS: C72.2 C73.1 CON2.1(VBUS) D6.5(VBUS) IC2.12(OUT)
VOUT: C25.1 C65.2 C66.2 C67.1 L7.2 L8.1 L9.1 R37.2
VSENSE: R38.1 R41.2 U6.6(VSENSE)
VSYS: C63.2 C64.1 R36.2 U6.1(VIN) U7.1(IN) ; port VSYS
NetC62_1: C62.1 L7.1 U6.2(PH)
NetC62_2: C62.2 U6.9(BOOT)
NetC69_1: C69.1 R40.1
NetC70_1: C70.1 R40.2 U6.7(COMP)
NetIC2_15: IC2.15(ILIM_LO) R46.2
NetIC2_16: IC2.16(ILIM_HI) R44.2 R45.2
NetR37_1: R37.1 R38.2
NetR39_2: R39.2 U6.10(RT)

Not connected (* = marked no-connect by the designer): CON2 5(StdA_SSRX-)* 6(StdA_SSRX+)* 7(GND_DRAIN)* 8(StdA_SSTX-)* 9(StdA_SSTX+)*; IC2 2(DM_OUT)* 3(DP_OUT)*; U7 4(NC)*

### Channels
MAIN/USBA1: designators end in _1; ports EN=EN VSYS=VSYS ~{FAULT}=~{FAULT} ~{STAT}=~{STAT}
MAIN/USBA2: designators end in _2; ports EN=EN VSYS=VSYS ~{FAULT}=~{FAULT} ~{STAT}=~{STAT}

### Notes on the sheet
- (near U6) never mount!
- (near U6) max 6V
- (near R37) 10k
- Switching freq.: 500kHz
  Vout: 5V
- (near IC2) CDP Mode
  Ilim = 2A
- Board:
- Author:
- Title:
- Project:
- SVN:
- Version:
- Sheet:
- of
- Contact:
- Modified:
- Size:
- A4

### Library data of the parts
C25 C62 C64 C67-C71 C73 C88 = NP-CAPACITOR: MLCC capacitor; Type: CAP
C63 = NP-CAPACITOR: as C20 on sheet OpenPack_BATMOD_V1p0_CHRG; Supplier: Mouser
C65 C66 C72 = NP-CAPACITOR: as C49 on sheet OpenPack_BATMOD_V1p0_PWR; Supplier: Mouser
CON2 = WE_692121030100: USB Connectors WR-COM 3.0 TypeA SMT 9Pin Horztl Female; Part number: 710-692121030100; ComponentLink1Description: Datasheet; Supplier: Mouser; ComponentLink2Description: Order; ComponentLink2URL: https://hu.mouser.com/en/ProductDetail/Wurth-Elektronik/692121030100?qs=e5m3IbTHPW%252BzU%252B9ZpCsp%2Fg%3D%3D; Type: IC
D6 = USBLC6-2SC6: as D1 on sheet OpenPack_BATMOD_V1p0_USBC; Supplier: Mouser; ComponentLink1Description: Datasheet; ComponentLink2Description: Order; ComponentLink2URL: https://hu.mouser.com/en/ProductDetail/STMicroelectronics/USBLC6-2SC6?qs=po45yt2pPpu%2FhNIlwQdTlg%3D%3D
IC1 = SN74AHC1G04: Signle inverter, 2V-5V; Part number: 595-SN74AHC1G04DCKT; Supplier: Mouser; Type: IC; ComponentLink1Description: Datasheet; ComponentLink2Description: Order; ComponentLink2URL: https://hu.mouser.com/ProductDetail/Texas-Instruments/SN74AHC1G04DCKT?qs=pdM4geFiyZTdyzHE1xB18A%3D%3D
IC2 = TPS2547RTER: USB Switch ICs USB charging port co ntroller and 3A pow A 595-TPS2547RTET; Part number: 595-TPS2547RTER; Supplier: Mouser; Type: IC; ComponentLink1Description: Datasheet; ComponentLink2Description: Order; ComponentLink2URL: https://hu.mouser.com/en/ProductDetail/Texas-Instruments/TPS2547RTER?qs=sGAEpiMZZMutXGli8Ay4kLXLEI0dbCtTlAK%2FeCGBCiY%3D
L7 = Inductance - 22uH: as L5 on sheet OpenPack_BATMOD_V1p0_PWR; Supplier: Mouser; ComponentLink1Description: Datasheet; ComponentLink2Description: Order; ComponentLink2URL: https://hu.mouser.com/en/ProductDetail/Coilcraft/MSS1038T-223MLC?qs=zCSbvcPd3pYngswiQ3YHhA%3D%3D
L8 L9 = WE_742792012: as L4 on sheet OpenPack_BATMOD_V1p0_PWR; Supplier: Mouser; ComponentLink1Description: Datasheet; ComponentLink2Description: Order; ComponentLink2URL: https://hu.mouser.com/en/ProductDetail/Wurth-Elektronik/742792012?qs=J4sk5G6CMwb1B4GP%2Fe%2FxmA%3D%3D
R36-R49 = RESISTOR: Metal Film Resistor; Type: RES
U6 = TPS54335A: as U5 on sheet OpenPack_BATMOD_V1p0_PWR; Supplier: Mouser; ComponentLink1Description: Datasheet; ComponentLink2Description: Order; ComponentLink2URL: https://hu.mouser.com/en/ProductDetail/Texas-Instruments/TPS54335ADRCR?qs=ADSrZYdIRCdK%252Bcxbafh6hw%3D%3D; Type: PWR-REG
U7 = TPS7E8250QDBVRQ1: LDO Voltage Regulators 5V, 300mA; Part number: 595-TPS7E8250QDBVRQ1; Supplier: Mouser; ComponentLink1Description: Datasheet; ComponentLink2Description: Order; ComponentLink2URL: https://hu.mouser.com/en/ProductDetail/Texas-Instruments/TPS7E8250QDBVRQ1?qs=KLj0QfLrw0E8KDpihcr47w%3D%3D; Type: PWR-REG

## Sheet OpenPack_BATMOD_V1p0_BAT.SchDoc
size A4; SheetNumber: 6; SheetTotal: 10; Title_: Battery Manager
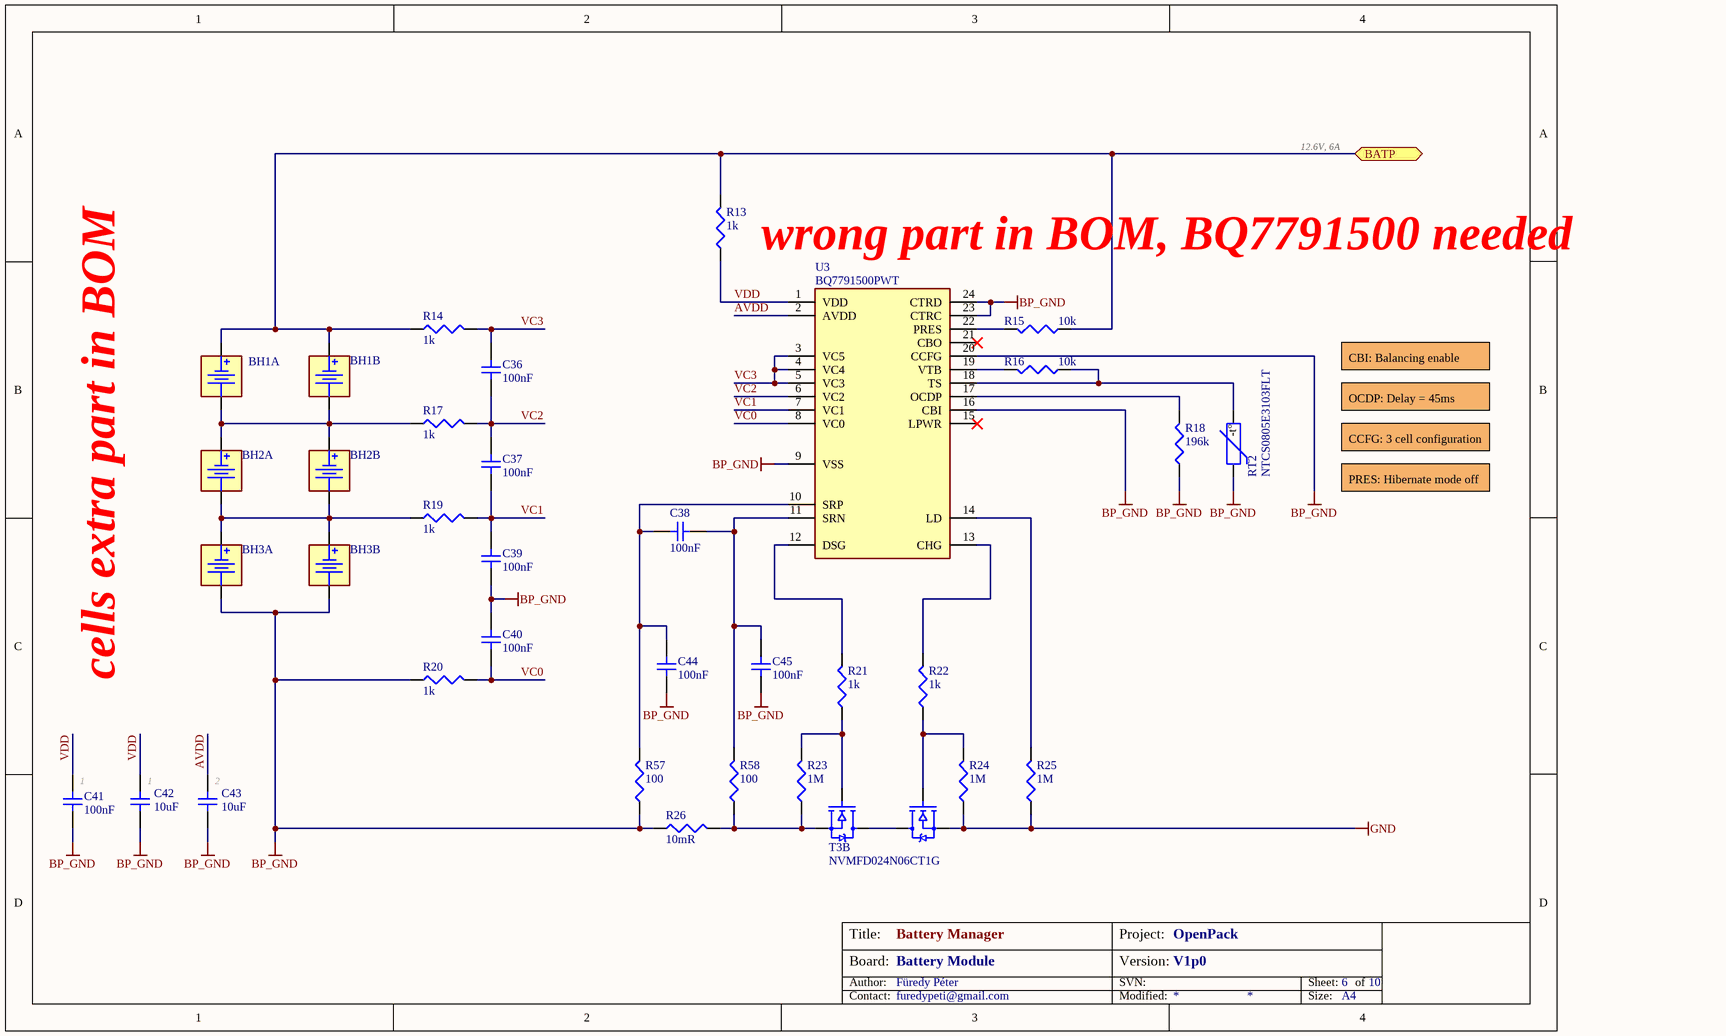
[diagram p8: OpenPack_BATMOD_V1p0_BAT.SchDoc]

### Parts
BH1  12BHC186P-GR  [12BHC186P-GR]  (value not drawn)  (parts A,B of 2)
BH2  12BHC186P-GR  [12BHC186P-GR]  (value not drawn)  (parts A,B of 2)
BH3  12BHC186P-GR  [12BHC186P-GR]  (value not drawn)  (parts A,B of 2)
C36  100nF  [CAP_0603]
C37  100nF  [CAP_0603]
C38  100nF  [CAP_0603]
C39  100nF  [CAP_0603]
C40  100nF  [CAP_0603]
C41  100nF  [CAP_0603]
C42  10uF  [CAP_1210]
C43  10uF  [CAP_1210]
C44  100nF  [CAP_0603]
C45  100nF  [CAP_0603]
R13  1k  [RES-0603]
R14  1k  [RES-0603]
R15  10k  [RES-0603]
R16  10k  [RES-0603]
R17  1k  [RES-0603]
R18  196k  [RES-0603]
R19  1k  [RES-0603]
R20  1k  [RES-0603]
R21  1k  [RES-0603]
R22  1k  [RES-0603]
R23  1M  [RES-0603]
R24  1M  [RES-0603]
R25  1M  [RES-0603]
R26  10mR  [RES-2512]
R57  100  [RES-0603]
R58  100  [RES-0603]
RT2  NTCS0805E3103FLT  [RES-0805]
T3  NVMFD024N06CT1G  [SO-8FL (DFN8)]  (value not drawn)  (parts A,B of 2)
U3  BQ7791500PWT  [TSSOP24]

### Ports
BATP (bidir, see OpenPack_BATMOD_V1p0_MAIN, OpenPack_BATMOD_V1p0_CHRG)

### Nets
BP_GND: BH3.1 BH3.3 C39.1 C40.2 C41.1 C42.1 C43.1 C44.1 C45.1 R18.1 R20.1 R26.1 R57.1 RT2.1 U3.9(VSS) U3.16(CBI) U3.20(CCFG) U3.23(CTRC) U3.24(CTRD)
GND: R24.1 R25.1 T3.3
AVDD: C43.2 U3.2(AVDD)
VC0: C40.1 R20.2 U3.8(VC0)
VC1: C37.1 C39.2 R19.2 U3.7(VC1)
VC2: C36.1 C37.2 R17.2 U3.6(VC2)
VC3: C36.2 R14.2 U3.3(VC5) U3.4(VC4) U3.5(VC3)
VDD: C41.2 C42.2 R13.1 U3.1(VDD)
NetBH1_1: BH1.1 BH1.3 BH2.2 BH2.4 R17.1
NetBH1_2: BH1.2 BH1.4 R13.2 R14.1 R15.1 ; port BATP
NetBH2_1: BH2.1 BH2.3 BH3.2 BH3.4 R19.1
NetC38_1: C38.1 C45.2 R58.2 U3.11(SRN)
NetC38_2: C38.2 C44.2 R57.2 U3.10(SRP)
NetR15_2: R15.2 U3.22(PRES)
NetR16_1: R16.1 RT2.2 U3.18(TS)
NetR16_2: R16.2 U3.19(VTB)
NetR18_2: R18.2 U3.17(OCDP)
NetR21_1: R21.1 R23.2 T3.2
NetR21_2: R21.2 U3.12(DSG)
NetR22_1: R22.1 R24.2 T3.4
NetR22_2: R22.2 U3.13(CHG)
NetR23_1: R23.1 R26.2 R58.1 T3.1
NetR25_2: R25.2 U3.14(LD)
NetT3_9: T3.9 T3.10

Not connected (* = marked no-connect by the designer): U3 15(LPWR)* 21(CBO)*

### Notes on the sheet
- 12.6V, 6A
- wrong part in BOM, BQ7791500 needed
- CBI: Balancing enable
- OCDP: Delay = 45ms
- CCFG: 3 cell configuration
- PRES: Hibernate mode off
- cells extra part in BOM
- (near C41) 1
- (near C42) 1
- (near C43) 2
- Board:
- Author:
- Title:
- Project:
- SVN:
- Version:
- Sheet:
- of
- Contact:
- Modified:
- Size:
- A4
- (in symbol NTCS0805E3103FLT) -t°

### Library data of the parts
BH1-BH3 = 12BHC186P-GR: Battery holder, 2x18650; Supplier: Mouser; Part number: 12BHC186P-GR; ComponentLink1Description: Order; Type: MECH; ComponentLink2Description: Datasheet; ComponentLink2URL: https://hu.mouser.com/en/ProductDetail/Eagle-Plastic-Devices/12BHC186P-GR?qs=AQlKX63v8Rv70Ee1H7gwgg%3D%3D
C36-C41 C44 C45 = NP-CAPACITOR: MLCC capacitor; Type: CAP
C42 C43 = NP-CAPACITOR: as C20 on sheet OpenPack_BATMOD_V1p0_CHRG; Supplier: Mouser
R13-R26 R57 R58 = RESISTOR: Metal Film Resistor; Type: RES
RT2 = NTCS0805E3103FLT: as RT1 on sheet OpenPack_BATMOD_V1p0_CHRG; Supplier: Mouser; Type: RES; ComponentLink1Description: Datasheet; ComponentLink2Description: Order; ComponentLink2URL: https://hu.mouser.com/en/ProductDetail/Vishay-BC-Components/NTCS0805E3103FLT?qs=%2FWiulJ9oly4Pd4lidS66Yw%3D%3D
T3 = NVMFD024N06CT1G: as T1 on sheet OpenPack_BATMOD_V1p0_MAN; ComponentLink1Description: Datasheet; Supplier: Mouser; ComponentLink2Description: Order; ComponentLink2URL: https://hu.mouser.com/en/ProductDetail/onsemi/NVMFD024N06CT1G?qs=GedFDFLaBXEbovCJp2BRhQ%3D%3D
U3 = BQ7791500PWT: Battery Management 3-series to 5-series stackable; Part number: 595-BQ7791506PWR; ComponentLink1Description: Datasheet; Supplier: Mouser; ComponentLink2Description: Order; ComponentLink2URL: https://hu.mouser.com/en/ProductDetail/Texas-Instruments/BQ7791506PWR?qs=GedFDFLaBXGRM0fZiEGV%2Fg%3D%3D; Type: IC

## Sheet OpenPack_BATMOD_V1p0_MCU.SchDoc
size A4; SheetNumber: 9; SheetTotal: 10; Title_: Microcontroller
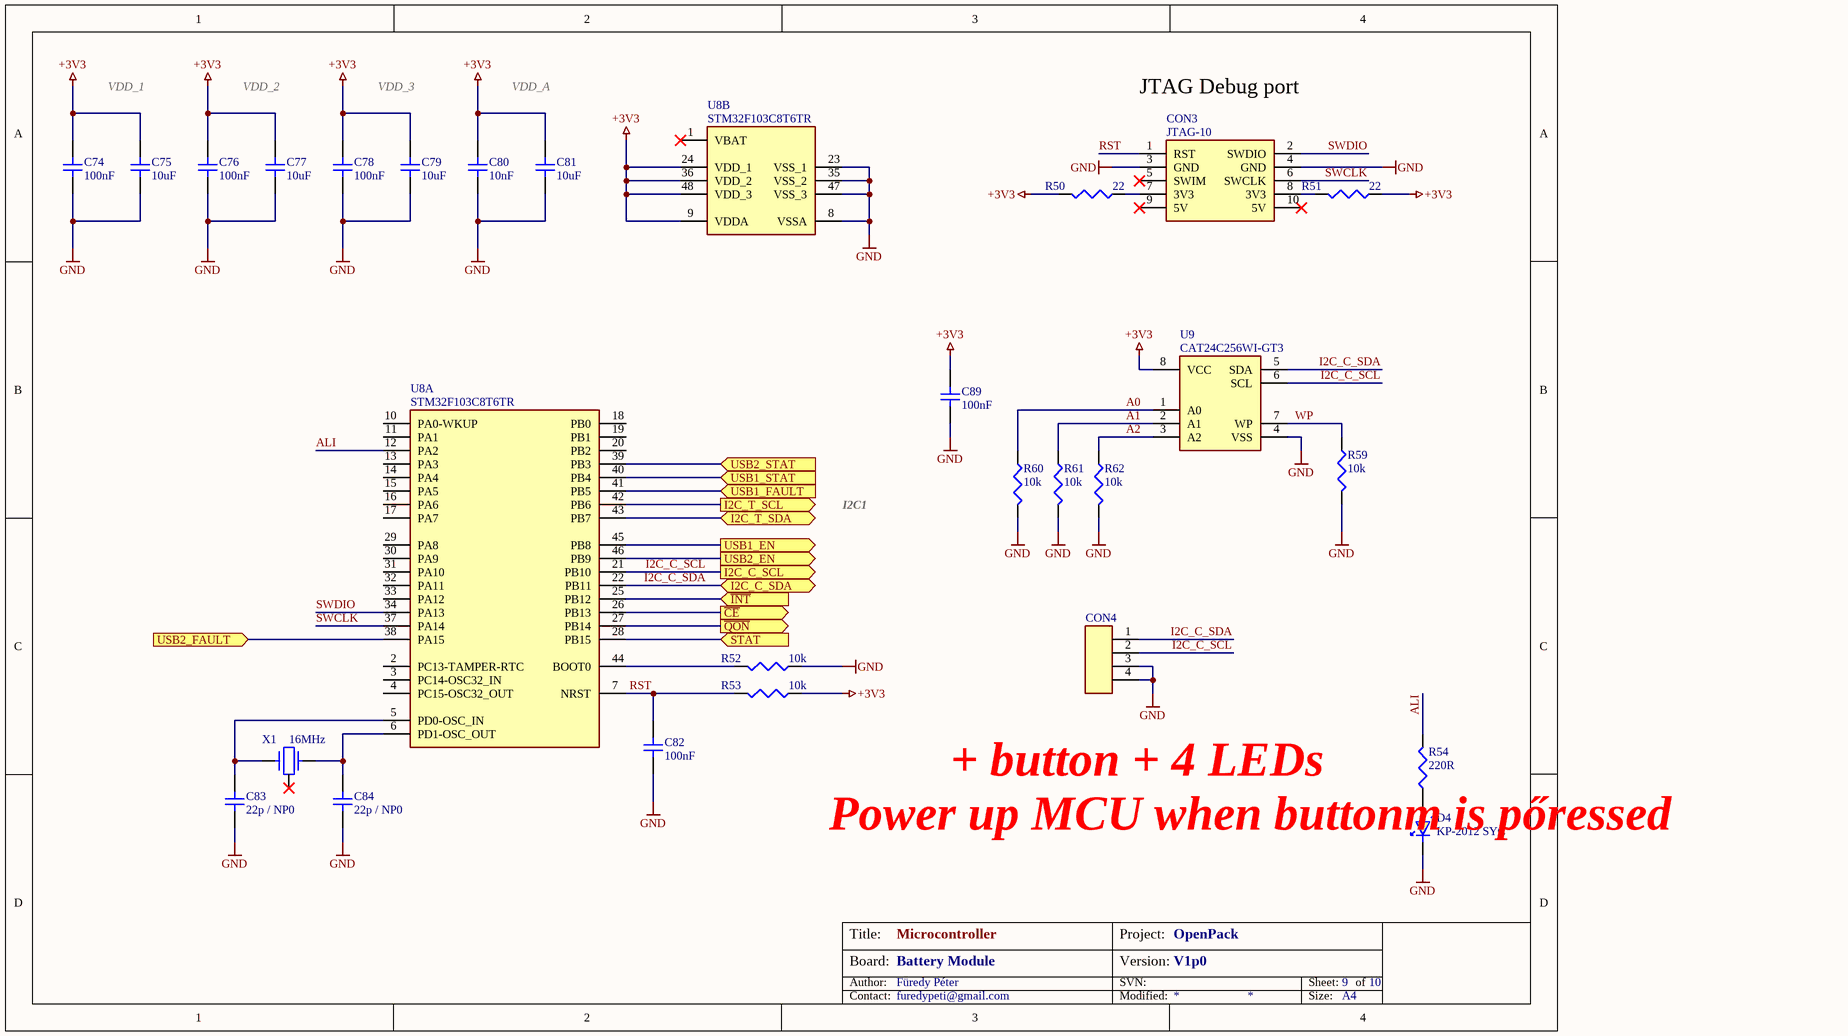
[diagram p9: OpenPack_BATMOD_V1p0_MCU.SchDoc]

### Parts
C74  100nF  [CAP_0603]
C75  10uF  [CAP_0603]
C76  100nF  [CAP_0603]
C77  10uF  [CAP_0603]
C78  100nF  [CAP_0603]
C79  10uF  [CAP_0603]
C80  10nF  [CAP_0603]
C81  10uF  [CAP_0603]
C82  100nF  [CAP_0603]
C83  22p / NP0  [CAP_0603]
C84  22p / NP0  [CAP_0603]
C89  100nF  [CAP_0603]
CON3  JTAG-10  [CON10-2x5]
CON4  CON4  [CON4_SIMPLE_TH]  (value not drawn)
D4  KP-2012 SYC  [KP-2012-GRN]
R50  22  [RES-0603]
R51  22  [RES-0603]
R52  10k  [RES-0603]
R53  10k  [RES-0603]
R54  220R  [RES-0603]
R59  10k  [RES-0603]
R60  10k  [RES-0603]
R61  10k  [RES-0603]
R62  10k  [RES-0603]
U8  STM32F103C8T6TR  [LQFP48_L]  (parts A,B of 2)
U9  CAT24C256WI-GT3  [SOIC8]
X1  16MHz  [XTAL-32x25]

### Ports
I2C_C_SCL (out, see OpenPack_BATMOD_V1p0_MAIN, OpenPack_BATMOD_V1p0_MAN), I2C_C_SDA (bidir, see OpenPack_BATMOD_V1p0_MAIN, OpenPack_BATMOD_V1p0_MAN), I2C_T_SCL (out, see OpenPack_BATMOD_V1p0_MAIN, OpenPack_BATMOD_V1p0_MAN), I2C_T_SDA (bidir, see OpenPack_BATMOD_V1p0_MAIN, OpenPack_BATMOD_V1p0_MAN), STAT (in, see OpenPack_BATMOD_V1p0_MAIN, OpenPack_BATMOD_V1p0_CHRG), USB1_EN (out, see OpenPack_BATMOD_V1p0_MAIN), USB1_FAULT (in, see OpenPack_BATMOD_V1p0_MAIN), USB1_STAT (in, see OpenPack_BATMOD_V1p0_MAIN), USB2_EN (out, see OpenPack_BATMOD_V1p0_MAIN), USB2_FAULT (in, see OpenPack_BATMOD_V1p0_MAIN), USB2_STAT (in, see OpenPack_BATMOD_V1p0_MAIN), ~{CE} (out, see OpenPack_BATMOD_V1p0_MAIN, OpenPack_BATMOD_V1p0_CHRG), ~{INT} (in, see OpenPack_BATMOD_V1p0_MAIN, OpenPack_BATMOD_V1p0_CHRG), ~{QON} (out, see OpenPack_BATMOD_V1p0_MAIN, OpenPack_BATMOD_V1p0_CHRG)

### Nets
+3V3: C74.2 C75.2 C76.2 C77.2 C78.2 C79.2 C80.2 C81.2 C89.2 R50.1 R51.2 R53.2 U8.9(VDDA) U8.24(VDD_1) U8.36(VDD_2) U8.48(VDD_3) U9.8(VCC)
GND: C74.1 C75.1 C76.1 C77.1 C78.1 C79.1 C80.1 C81.1 C82.1 C83.1 C84.1 C89.1 CON3.3(GND) CON3.4(GND) CON4.3 CON4.4 D4.2 R52.2 R59.1 R60.1 R61.1 R62.1 U8.8(VSSA) U8.23(VSS_1) U8.35(VSS_2) U8.47(VSS_3) U9.4(VSS)
A0: R60.2 U9.1(A0)
A1: R61.2 U9.2(A1)
A2: R62.2 U9.3(A2)
ALI: R54.1 U8.12(PA2)
~{CE}: U8.26(PB13) ; port ~{CE}
I2C_C_SCL: CON4.2 U8.21(PB10) U9.6(SCL) ; port I2C_C_SCL
I2C_C_SDA: CON4.1 U8.22(PB11) U9.5(SDA) ; port I2C_C_SDA
I2C_T_SCL: U8.42(PB6) ; port I2C_T_SCL
I2C_T_SDA: U8.43(PB7) ; port I2C_T_SDA
~{INT}: U8.25(PB12) ; port ~{INT}
~{QON}: U8.27(PB14) ; port ~{QON}
RST: C82.2 CON3.1(RST) R53.1 U8.7(NRST)
STAT: U8.28(PB15) ; port STAT
SWCLK: CON3.6(SWCLK) U8.37(PA14)
SWDIO: CON3.2(SWDIO) U8.34(PA13)
WP: R59.2 U9.7(WP)
NetC83_2: C83.2 U8.5(PD0-OSC_IN) X1.1
NetC84_2: C84.2 U8.6(PD1-OSC_OUT) X1.3
NetCON3_7: CON3.7(3V3) R50.2
NetCON3_8: CON3.8(3V3) R51.1
NetD4_1: D4.1 R54.2
NetR52_1: R52.1 U8.44(BOOT0)
NetU8_38: U8.38(PA15) ; port USB2_FAULT
NetU8_39: U8.39(PB3) ; port USB2_STAT
NetU8_40: U8.40(PB4) ; port USB1_STAT
NetU8_41: U8.41(PB5) ; port USB1_FAULT
NetU8_45: U8.45(PB8) ; port USB1_EN
NetU8_46: U8.46(PB9) ; port USB2_EN
NetX1_2: X1.2 X1.4

Not connected (* = marked no-connect by the designer): CON3 5(SWIM)* 9(5V)* 10(5V)*; U8 1(VBAT)* 2(PC13-TAMPER-RTC) 3(PC14-OSC32_IN) 4(PC15-OSC32_OUT) 10(PA0-WKUP) 11(PA1) 13(PA3) 14(PA4) 15(PA5) 16(PA6) 17(PA7) 18(PB0) 19(PB1) 20(PB2) 29(PA8) 30(PA9) 31(PA10) 32(PA11) 33(PA12)

### Notes on the sheet
- VDD_1
- VDD_2
- VDD_3
- VDD_A
- JTAG Debug port
- I2C1
- + button + 4 LEDs
- Power up MCU when buttonm is pőressed
- Board:
- Author:
- Title:
- Project:
- SVN:
- Version:
- Sheet:
- of
- Contact:
- Modified:
- Size:
- A4

### Library data of the parts
C74-C84 C89 = NP-CAPACITOR: MLCC capacitor; Type: CAP
CON3 = JTAG: JTAG programing connector, 10pin; Part number: 100.261.60; Type: CON; Supplier: Hestore; ComponentLink1Description: Datasheet; ComponentLink1URL: ZL231-10PG_EN_10026160.pdf; ComponentLink2Description: Order; ComponentLink2URL: https://www.hestore.hu/prod_10026160.html
CON4 = CON4: Simple 4pin THT, 2.54mm
D4 = KP-2012 SYC: Yellow LED; Part number: 100.290.81; Type: Diode; ComponentLink1Description: Datasheet; ComponentLink1URL: KP-2012SYC_EN_10029081.pdf; Supplier: Hestore; ComponentLink2Description: Order; ComponentLink2URL: https://www.hestore.hu/prod_10029081.html
R50-R54 R59-R62 = RESISTOR: Metal Film Resistor; Type: RES
U8 = STM32F103C8T6TR: ARM MCU, Cortex-M3, 32 bit, 72 MHz, 64 KB; Part number: 3129604; Supplier: Farnell; ComponentLink1Description: Datasheet; ComponentLink1URL: SGST-S-A0001117293-1.pdf; ComponentLink2Description: Order; ComponentLink2URL: https://hu.farnell.com/stmicroelectronics/stm32f103c8t6tr/mcu-32bit-72mhz-lqfp-48/dp/3129604?st=stm32f103c8t6tr; Type: IC
U9 = CAT24C256WI-GT3: EEPROM 256kb I2C; Part number: 698-CAT24C256WI-GT3; ComponentLink1Description: Datasheet; Supplier: Mouser; ComponentLink2Description: Order; ComponentLink2URL: https://hu.mouser.com/en/ProductDetail/onsemi/CAT24C256WI-GT3?qs=rZgeL6XvLwaEqwp5Dppodg%3D%3D; Type: IC
X1 = 16M-SMD3225: Crystal oscillator, 16MHz, ±10ppm; Part number: 100.387.05; Type: OTHER; Supplier: Hestore; ComponentLink1Description: Datasheet; ComponentLink1URL: 3225-12M-SR_EN_10044508.pdf; ComponentLink2Description: Order; ComponentLink2URL: https://www.hestore.hu/prod_10038705.html

## Nets that join several sheets
+3V3: OpenPack_BATMOD_V1p0_MAN (7 pins), MAIN/USBA1 (C71_1.1 IC1_1.5), MAIN/USBA2 (C71_2.1 IC1_2.5), OpenPack_BATMOD_V1p0_MCU (17 pins)
GND: OpenPack_BATMOD_V1p0_CHRG (23 pins), OpenPack_BATMOD_V1p0_PWR (23 pins), OpenPack_BATMOD_V1p0_MAN (22 pins), OpenPack_BATMOD_V1p0_USBC (14 pins), MAIN/USBA1 (30 pins), MAIN/USBA2 (30 pins), OpenPack_BATMOD_V1p0_BAT (R24.1 R25.1 T3.3), OpenPack_BATMOD_V1p0_MCU (27 pins)
~{CE}: OpenPack_BATMOD_V1p0_CHRG (U2.13), OpenPack_BATMOD_V1p0_MCU (U8.26)
EN: MAIN/USBA1 (IC2_1.5 R49_1.1), MAIN/USBA2 (IC2_2.5 R49_2.1)
~{FAULT}: MAIN/USBA1 (IC2_1.13 R48_1.1), MAIN/USBA2 (IC2_2.13 R48_2.1)
I2C_C_SCL: OpenPack_BATMOD_V1p0_MAN (R2.1 U1.16), OpenPack_BATMOD_V1p0_MCU (CON4.2 U8.21 U9.6)
I2C_C_SDA: OpenPack_BATMOD_V1p0_MAN (R3.1 U1.15), OpenPack_BATMOD_V1p0_MCU (CON4.1 U8.22 U9.5)
I2C_T_SCL: OpenPack_BATMOD_V1p0_MAN (R4.1 U1.9), OpenPack_BATMOD_V1p0_MCU (U8.42)
I2C_T_SDA: OpenPack_BATMOD_V1p0_MAN (R5.1 U1.8), OpenPack_BATMOD_V1p0_MCU (U8.43)
~{INT}: OpenPack_BATMOD_V1p0_CHRG (U2.21), OpenPack_BATMOD_V1p0_MCU (U8.25)
NetBH1_2: OpenPack_BATMOD_V1p0_CHRG (C34.2 C35.2 R12.1 T2.4), OpenPack_BATMOD_V1p0_BAT (5 pins)
~{QON}: OpenPack_BATMOD_V1p0_CHRG (U2.12), OpenPack_BATMOD_V1p0_MCU (U8.27)
~{STAT}: MAIN/USBA1 (IC2_1.9 R42_1.2 R47_1.1), MAIN/USBA2 (IC2_2.9 R42_2.2 R47_2.1)
STAT: OpenPack_BATMOD_V1p0_CHRG (D5.K U2.1), OpenPack_BATMOD_V1p0_MCU (U8.28)
USB_CC1: OpenPack_BATMOD_V1p0_MAN (U1.24), OpenPack_BATMOD_V1p0_USBC (D2.6)
USB_CC2: OpenPack_BATMOD_V1p0_MAN (U1.25), OpenPack_BATMOD_V1p0_USBC (D2.4)
USB_DN: OpenPack_BATMOD_V1p0_MAN (U1.23), OpenPack_BATMOD_V1p0_USBC (D1.4)
USB_DP: OpenPack_BATMOD_V1p0_MAN (U1.22), OpenPack_BATMOD_V1p0_USBC (D1.6)
VI/O: OpenPack_BATMOD_V1p0_CHRG (8 pins), OpenPack_BATMOD_V1p0_MAN (6 pins)
VSYS: OpenPack_BATMOD_V1p0_CHRG (C22.2 C23.2 C24.2 U2.25), OpenPack_BATMOD_V1p0_PWR (8 pins), MAIN/USBA1 (5 pins), MAIN/USBA2 (5 pins)
VUSB: OpenPack_BATMOD_V1p0_MAN (7 pins), OpenPack_BATMOD_V1p0_USBC (10 pins)

## Assembly variants
DP: not fitted C26 C33 C74 C75 C76 C77 C78 C79 C80 C81 C82 C83 C84 CON3 D4 R6 R10 R36_USBA1 R36_USBA2 R43_USBA1 R43_USBA2 R46_USBA1 R46_USBA2 R50 R51 R52 R53 R54 U8 X1